# Altium project 0419.PrjPcb
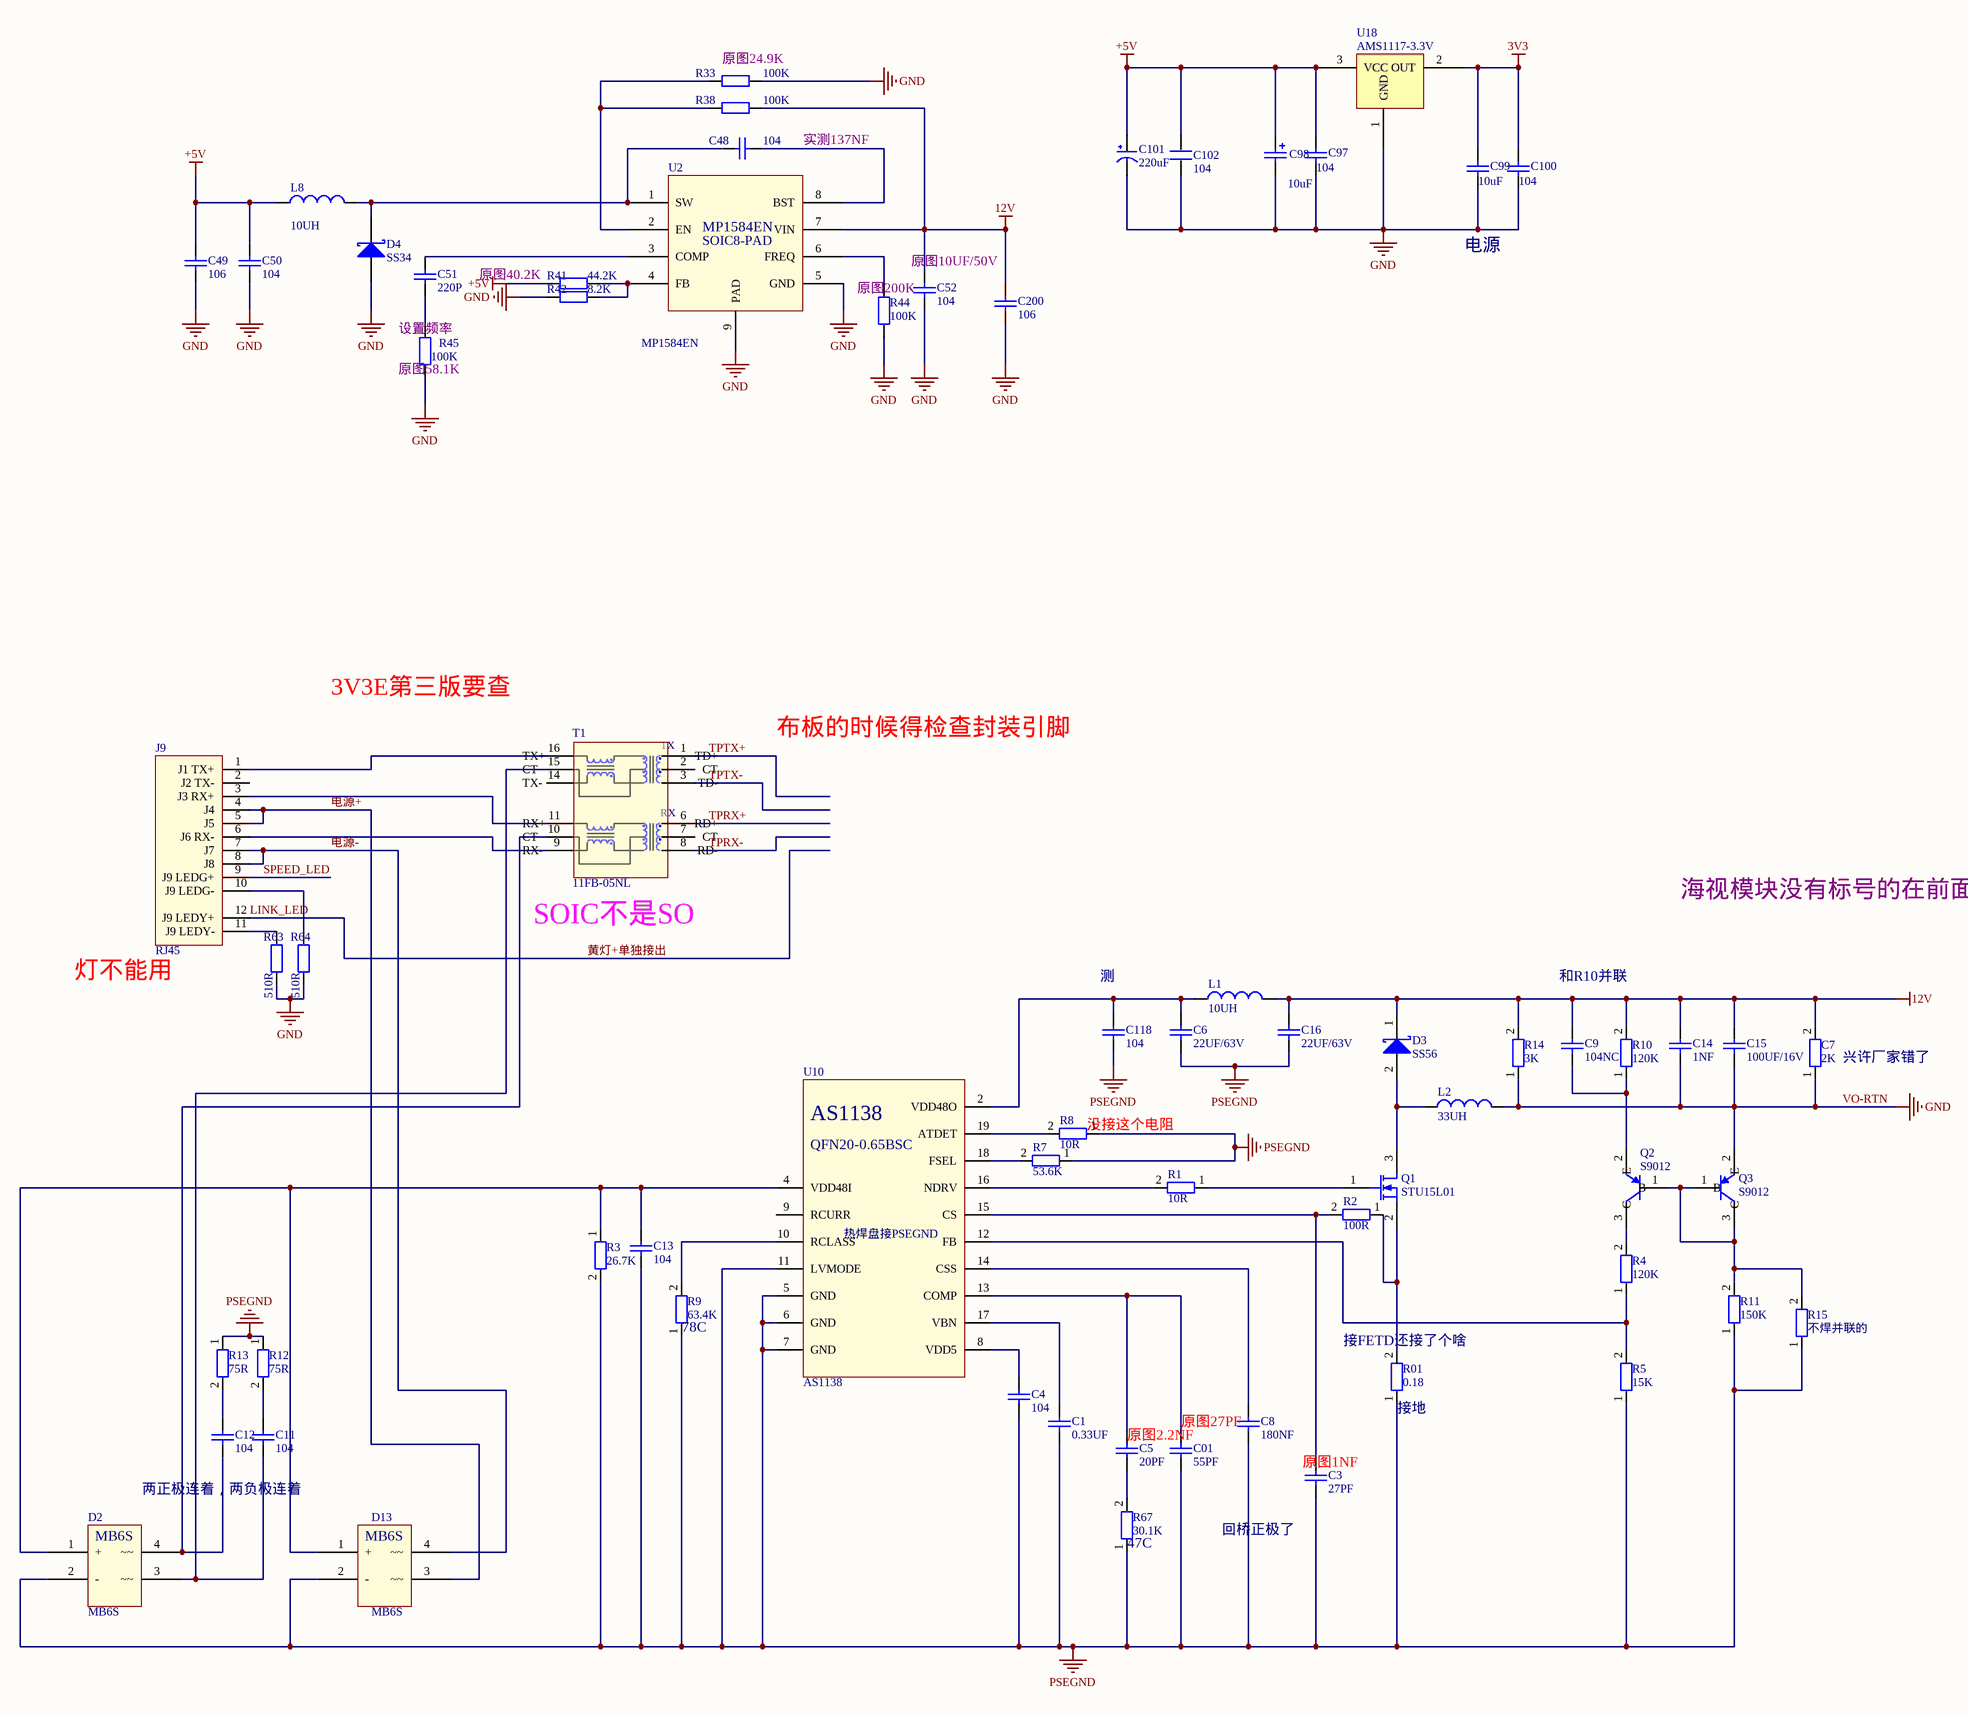
[diagram p0: POWER.SchDoc]
2 sheets, 258 parts. Net scope: global (net labels, ports and power ports of the same name join across sheets).
Board file: 0422.PcbDoc
Sheets:
  POWER.SchDoc
  407VS429.SchDoc

## Sheet POWER.SchDoc
size A2

### Parts
C01  55PF  [0603T]
C1  0.33UF  [0603T]
C3  27PF  [0603T]
C4  104  [0603T]
C5  20PF  [0603T]
C6  22UF/63V  [CAP-SIP]
C7  2K  [0603T]
C8  180NF  [0603T]
C9  104NC  [0603T]
C11  104  [0603T]
C12  104  [0603T]
C13  104  [0603T]
C14  1NF  [1206]
C15  100UF/16V  [CAP-SIP]
C16  22UF/63V  [CAP-SIP]
C48  104  [0603T]
C49  106  [1206]
C50  104  [0603T]
C51  220P  [0603T]
C52  104  [0603T]
C97  104  [0603T]
C98  10uF  [CAP-SIP]
C99  10uF  [0603T]
C100  104  [0603T]
C101  220uF  [7343E型]
C102  104  [0603T]
C118  104  [0603T]
C200  106  [1206]
D2  MB6S  [SOP-4]
D3  SS56  [SMC]
D4  SS34  [SMB]
D13  MB6S  [SOP-4]
J9  RJ45  [RJ45]
L1  10UH  [4*4电感]
L2  33UH  [L10*10]
L8  value 10UH  [6*6电感]  (hidden comment: Inductor)
Q1  STU15L01  [TO-252AA(D-PAK)]
Q2  S9012  [SOT-23]
Q3  S9012  [SOT-23]
R01  0.18  [3.5X2.8X1.9]
R1  10R  [0603T]
R2  100R  [0603T]
R3  26.7K  [0603T]
R4  120K  [0603T]
R5  15K  [0603T]
R7  53.6K  [0603T]
R8  10R  [0603T]
R9  63.4K  [0603T]
R10  120K  [0603T]
R11  150K  [0603T]
R12  75R  [0603T]
R13  75R  [0603T]
R14  3K  [0603T]
R15  不焊并联的  [0603T]
R33  100K  [0603T]
R38  100K  [0603T]
R41  44.2K  [0603T]
R42  8.2K  [0603T]
R44  100K  [0603T]
R45  100K  [0603T]
R63  value 510R  [0603T]  (hidden comment: Res)
R64  value 510R  [0603T]  (hidden comment: Res)
R67  30.1K  [0603T]
T1  11FB-05NL  [SOIC16]
U2  MP1584EN  [SOIC8-PAD]
U10  AS1138  [QFN20-0.65BSC-PAD]
U18  AMS1117-3.3V  [SOT-223]

### Nets
3V3: C99.2 C100.2 U18.2(OUT)
12V: C7.2 C9.1 C14.2 C15.2 C16.2 C52.2 C200.2 D3.1(K) L1.2 R10.2 R14.2 R38.2 U2.7(VIN)
+5V: C49.2 C50.2 C97.2 C98.1 C101.1(VCC) C102.2 L8.1 R41.2 U18.3(VCC)
GND: C7.1 C14.1 C15.1 C49.1 C50.1 C52.1 C97.1 C98.2 C99.1 C100.1 C101.2(GND) C102.1 C200.1 D4.1(A) L2.2 Q3.2(E) R14.1 R33.2 R42.2 R44.2 R45.2 R63.2 R64.2 U2.5(GND) U2.9(PAD) U18.1(GND)  [also labelled VO-RTN]
PSEGND: C01.2 C1.2 C3.2 C4.2 C6.1 C8.2 C13.2 C16.1 C118.1 D2.2(-) D13.2(-) R01.1 R3.2 R5.1 R7.1 R8.1 R9.1 R11.1 R12.1 R13.1 R15.1 R67.1 U10.5(GND) U10.6(GND) U10.7(GND) U10.11(LVMODE)
LINK_LED: J9.12(J9_LEDY+)  [also labelled 黄灯+单独接出]
SPEED_LED: J9.9(J9_LEDG+)
TPRX+: T1.6(RD+)
TPRX-: T1.8(RD-)
TPTX+: T1.1(TD+)
TPTX-: T1.3(TD-)
电源+: D13.3(~~) J9.4(J4) J9.5(J5)
电源-: D13.4(~~) J9.7(J7) J9.8(J8)
NetC01_1: C01.1 C5.1 U10.13(COMP)
NetC1_1: C1.1 U10.17(VBN)
NetC3_1: C3.1 R2.2 U10.15(CS)
NetC4_1: C4.1 U10.8(VDD5)
NetC5_2: C5.2 R67.2
NetC6_2: C6.2 C118.2 L1.1 U10.2(VDD48O)
NetC8_1: C8.1 U10.14(CSS)
NetC9_2: C9.2 Q2.2(E) R10.1
NetC11_1: C11.1 R12.2
NetC11_2: C11.2 D2.3(~~) T1.15(CT)
NetC12_1: C12.1 R13.2
NetC12_2: C12.2 D2.4(~~) T1.10(CT)
NetC13_1: C13.1 D2.1(+) D13.1(+) R3.1 U10.4(VDD48I)
NetC48_1: C48.1 U2.8(BST)
NetC48_2: C48.2 D4.2(K) L8.2 U2.1(SW)
NetC51_1: C51.1 R45.1
NetC51_2: C51.2 U2.3(COMP)
NetD3_2: D3.2(A) L2.1 Q1.3(D)
NetJ9_1: J9.1(J1_TX+) T1.16(TX+)
NetJ9_3: J9.3(J3_RX+) T1.11(RX+)
NetJ9_6: J9.6(J6_RX-) T1.9(RX-)
NetJ9_10: J9.10(J9_LEDG-) R64.1
NetJ9_11: J9.11(J9_LEDY-) R63.1
NetQ1_1: Q1.1(G) R1.1
NetQ1_2: Q1.2(S) R01.2 R2.1
NetQ2_1: Q2.1(B) Q3.1(B) Q3.3(C) R11.2 R15.2
NetQ2_3: Q2.3(C) R4.2
NetR1_2: R1.2 U10.16(NDRV)
NetR4_1: R4.1 R5.2 U10.12(FB)
NetR7_2: R7.2 U10.18(FSEL)
NetR8_2: R8.2 U10.19(ATDET)
NetR9_2: R9.2 U10.10(RCLASS)
NetR33_1: R33.1 R38.1 U2.2(EN)
NetR41_1: R41.1 R42.1 U2.4(FB)
NetR44_1: R44.1 U2.6(FREQ)

Not connected (* = marked no-connect by the designer): J9 2(J2_TX-); T1 2(CT) 7(CT) 14(TX-); U10 9(RCURR)

### Notes on the sheet
- (near R33) 原图24.9K
- 实测137NF
- 原图40.2K
- (near C52) 原图10UF/50V
- 电源
- (near R45) 设置频率
- (near R44) 原图200K
- (near R45) 原图58.1K
- 3V3E第三版要查
- 布板的时候得检查封装引脚
- (near T1) SOIC不是SO
- 海视模块没有标号的在前面添0
- 灯不能用
- (near C118) 测
- 和R10并联
- (near C7) 兴许厂家错了
- (near R8) 没接这个电阻
- (near U10) 热焊盘接PSEGND
- (near R9) 78C
- (near R01) 接FETD还接了个啥
- 原图27PF
- (near R01) 接地
- 两正极连着，两负极连着
- 原图2.2NF
- (near C3) 原图1NF
- (near R67) 47C
- 回桥正极了
- (in symbol 11FB-05NL) TX; RX
- (in symbol AS1138) QFN20-0.65BSC
- (in symbol MP1584EN顺序) SOIC8-PAD

### Library data of the parts
C01 C1 C3-C6 C8 C9 C11-C16 C48-C52 C118 C200 = Cap: Capacitor; Value: 100pF; Published: 8-Jun-2000; LatestRevisionDate: 17-Jul-2002; LatestRevisionNote: Re-released for DXP Platform.; PackageReference: RAD-0.3; Publisher: Altium Limited; PackageDescription: Radial Cap, Thru-Hole; 2 Leads; 0.3 in Pin Spacing
C7 R01 R1-R5 R7-R15 R33 R38 R41 R42 R44 R45 R67 = Res2: Resistor; Value: 1K; Published: 8-Jun-2000; LatestRevisionDate: 17-Jul-2002; LatestRevisionNote: Re-released for DXP Platform.; PackageReference: AXIAL-0.4; Publisher: Altium Limited; PackageDescription: Axial Device, Thru-Hole; 2 Leads; 0.4 in Pin Spacing
C97 C100 = Cap: Capacitor; Value: 100nF; Published: 8-Jun-2000; LatestRevisionDate: 17-Jul-2002; LatestRevisionNote: Re-released for DXP Platform.; PackageReference: RAD-0.3; Publisher: Altium Limited; PackageDescription: Radial Cap, Thru-Hole; 2 Leads; 0.3 in Pin Spacing
C98 = Cap Pol2: Polarized Capacitor (Axial); Published: 8-Jun-2000; LatestRevisionDate: 17-Jul-2002; LatestRevisionNote: Re-released for DXP Platform.; PackageReference: POLAR0.8; Publisher: Altium Limited; PackageDescription: Polarized Capacitor; 2 Leads; Value: 10uF
C99 = Cap: Capacitor; Published: 8-Jun-2000; LatestRevisionDate: 17-Jul-2002; LatestRevisionNote: Re-released for DXP Platform.; PackageReference: RAD-0.3; Publisher: Altium Limited; PackageDescription: Radial Cap, Thru-Hole; 2 Leads; 0.3 in Pin Spacing; Value: 10uF
C101 = CAP
C102 = C
D3 = Diode 10TQ035: Schottky Rectifier; Note: Terminal 2 is the TAB and is electrically connected to the cathode; Published: 8-Jun-2000; LatestRevisionDate: 17-Jul-2002; LatestRevisionNote: Re-released for DXP Platform.; DatasheetVersion: PD-2.057B; PackageVersion: Feb-1998; PackageReference: TO-220AC; Publisher: Altium Limited; PackageDescription: TO, Thru-Hole, Vertical, Heatsink Mounted; 3 In-Line Leads (1 Absent); Pitch 2.54 mm; ComponentLink1Description: Manufacturer Link; ComponentLink1URL: http://www.irf.com/; ComponentLink2Description: Datasheet; ComponentLink2URL: http://www.irf.com/product-info/datasheets/data/10tq.pdf
D4 = D Schottky: Schottky Diode; Published: 8-Jun-2000; LatestRevisionDate: 17-Jul-2002; LatestRevisionNote: Re-released for DXP Platform.; PackageReference: SMB; Publisher: Altium Limited; PackageDescription: DO-214-AA/SMB; 2 C-Bend Leads; Body 5.3 x 3.6 mm, inc. leads (LxW); Code_JEDEC: DO-214-AA
L1 L8 = Inductor: Code_IEC: 1005; Published: 8-Jun-2000; LatestRevisionDate: 29-May-2009; LatestRevisionNote: IPC-7351 Footprint Added.; PackageReference: 0402-A; Publisher: Altium Limited; PackageDescription: Chip Inductor; Code_JEITA: 0402
  L1: Value: 10UH
L2 = Inductor: Code_IEC: 1005; Value: 10UH; Published: 8-Jun-2000; LatestRevisionDate: 29-May-2009; LatestRevisionNote: IPC-7351 Footprint Added.; PackageReference: 0402-A; Publisher: Altium Limited; PackageDescription: Chip Inductor; Code_JEITA: 0402
Q1 = MOSFET-N: N-Channel MOSFET; Published: 8-Jun-2000; LatestRevisionDate: 17-Jul-2002; LatestRevisionNote: Re-released for DXP Platform.; PackageVersion: 1995/1996; PackageReference: E3; Publisher: Altium Limited; PackageDescription: TO, Flat Index; 3 In-Line, Axial Leads; Body Dia. 4.6mm; Lead Dia. 0.5 mm (max)
Q2 Q3 = S9012: NPN General Purpose Amplifier; Published: 8-Jun-2000; LatestRevisionDate: 15-Jan-2003; LatestRevisionNote: PCB Footprint 'BCY-W3/D4.7' replaced; DatasheetVersion: 1997; PackageVersion: Sep-1998; PackageReference: TO-92A; Publisher: Altium Limited; PackageDescription: TO, Flat Index; 3 In-Line, Axial Leads; Body Dia. 4.5mm; Leads 0.51 x 0.48 mm (max); ComponentLink1Description: Manufacturer Link; ComponentLink1URL: http://www.fairchildsemi.com/; ComponentLink2Description: Datasheet; ComponentLink2URL: http://www.fairchildsemi.com/ds/2N%2F2N3904.pdf
R63 R64 = Res2: Resistor; Published: 8-Jun-2000; LatestRevisionDate: 17-Jul-2002; LatestRevisionNote: Re-released for DXP Platform.; PackageReference: AXIAL-0.4; Publisher: Altium Limited; PackageDescription: Axial Device, Thru-Hole; 2 Leads; 0.4 in Pin Spacing
U2 = MP1584EN顺序
U18 = 11

## Sheet 407VS429.SchDoc
size A1; Organization: Protel International P/L; Address1: L3, 12a Rodborough Rd; Address2: Frenchs Forest; Address3: NSW; Address4: Australia 2086
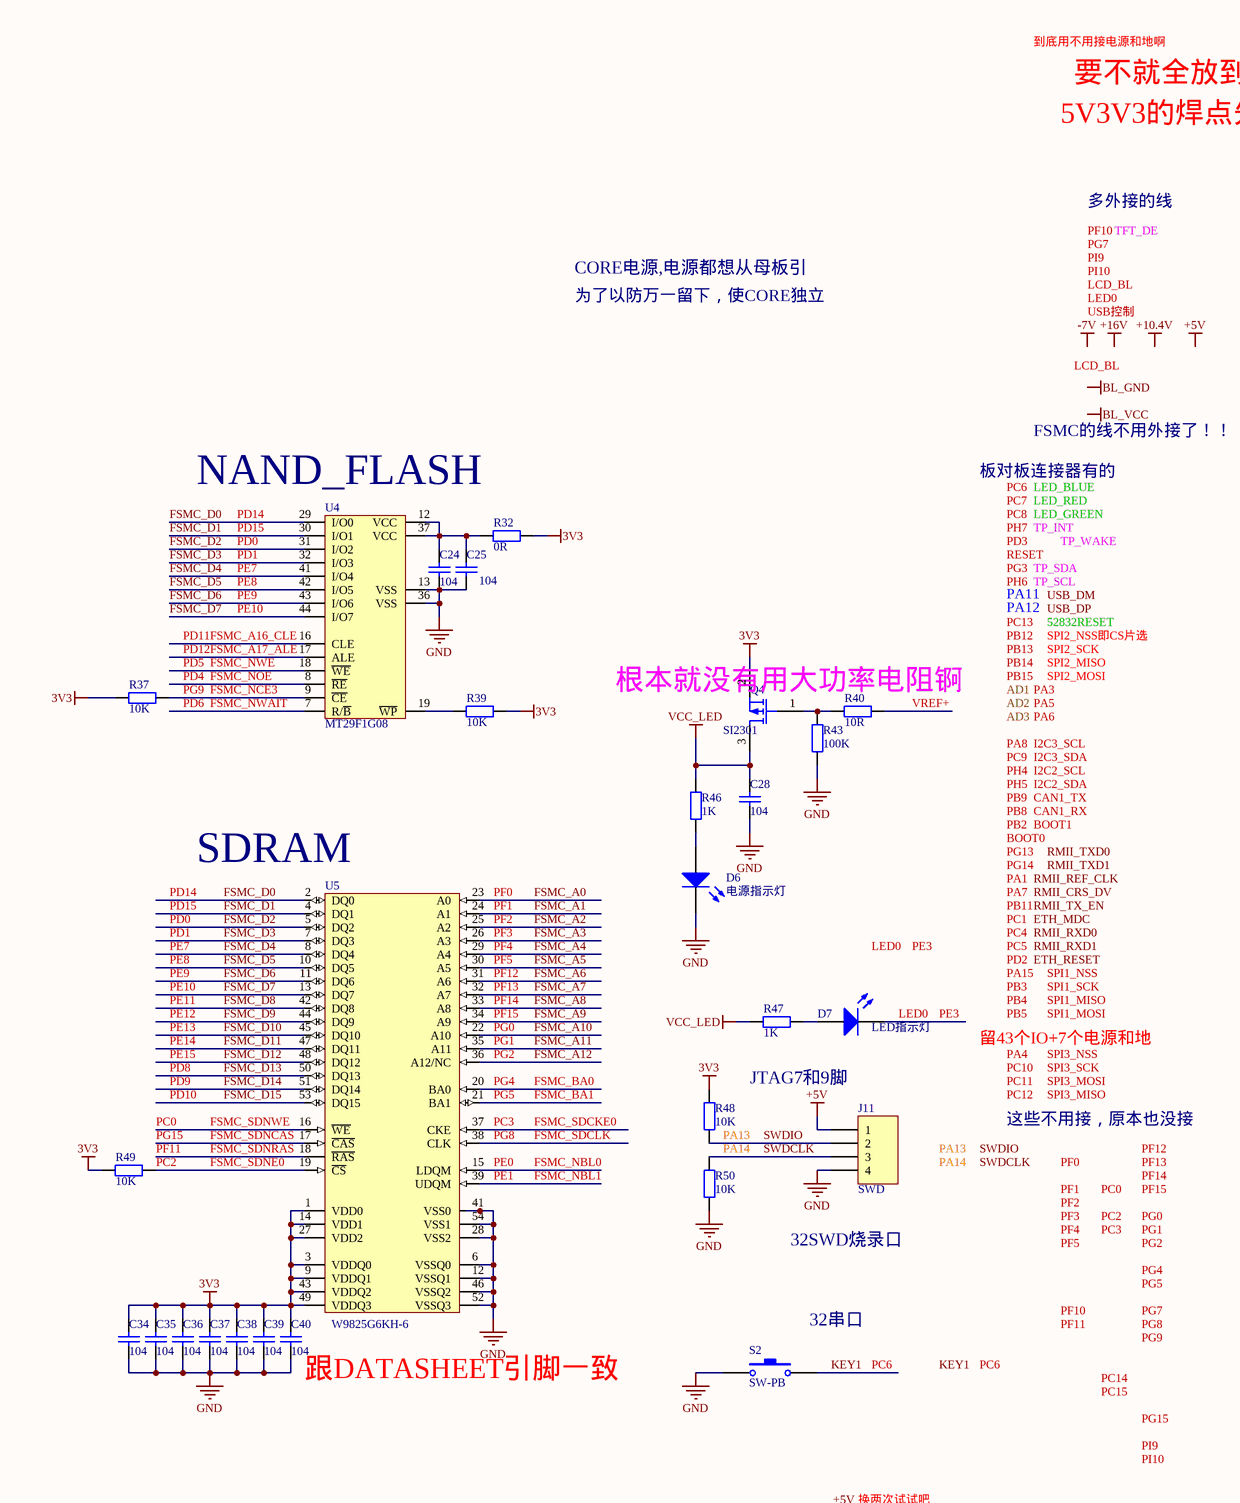
[diagram p1: 407VS429.SchDoc, top left]
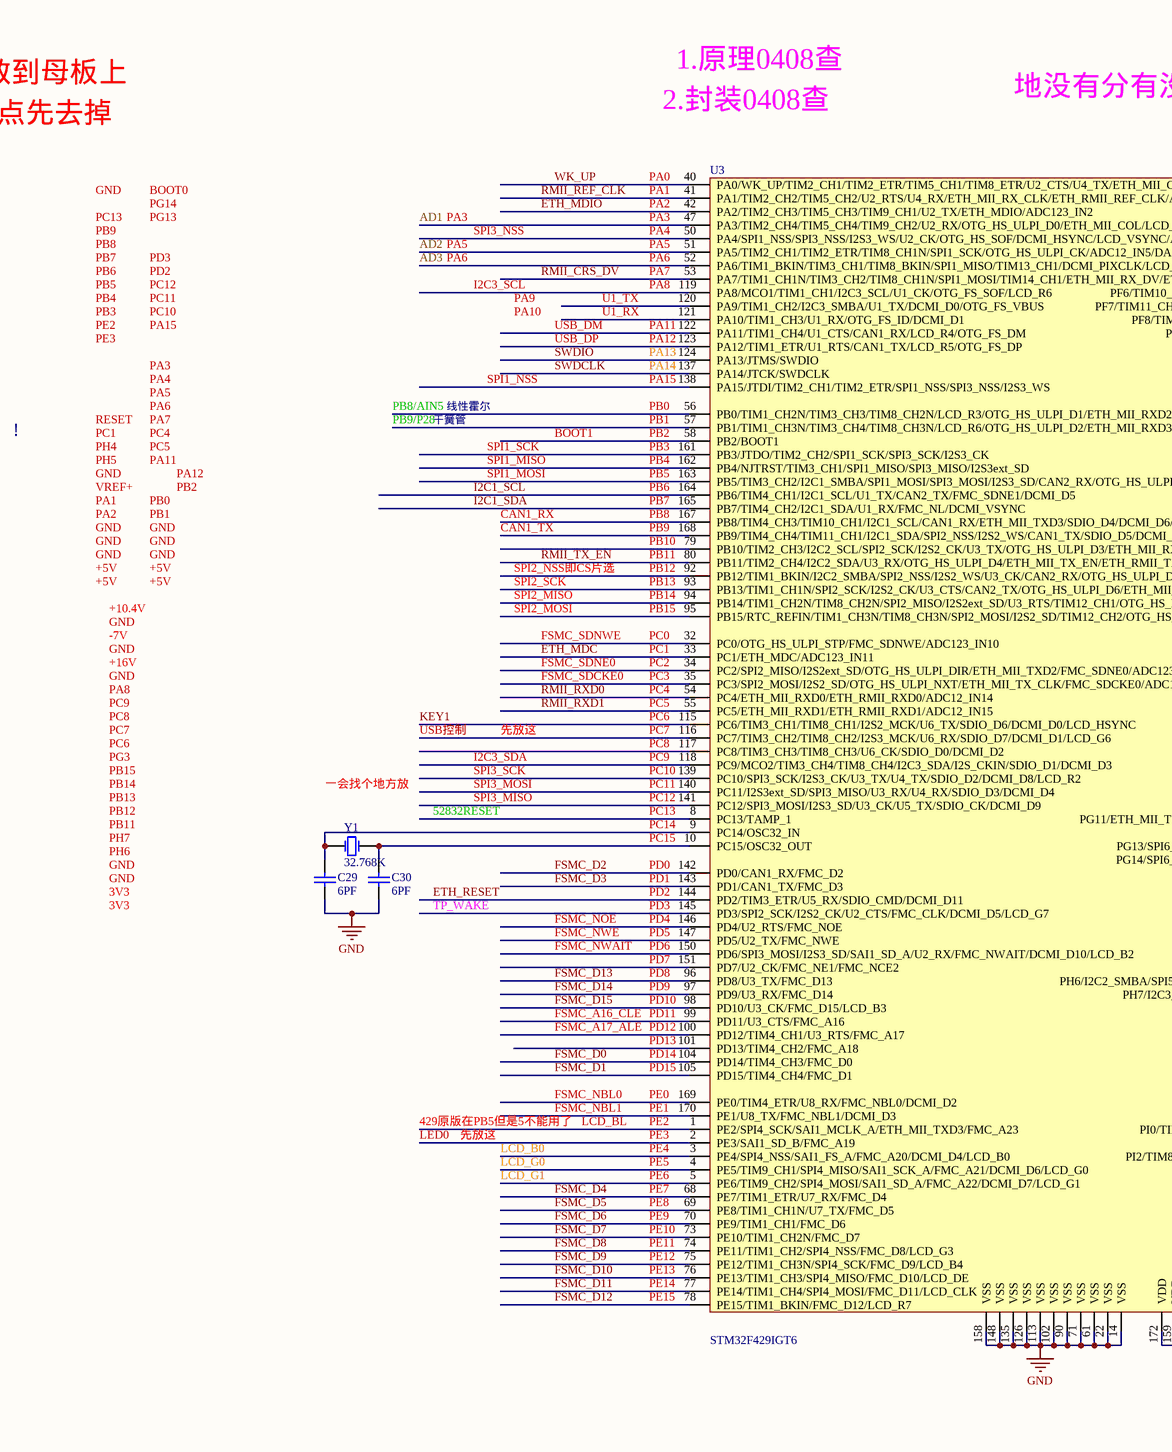
[diagram p2: 407VS429.SchDoc, top middle]
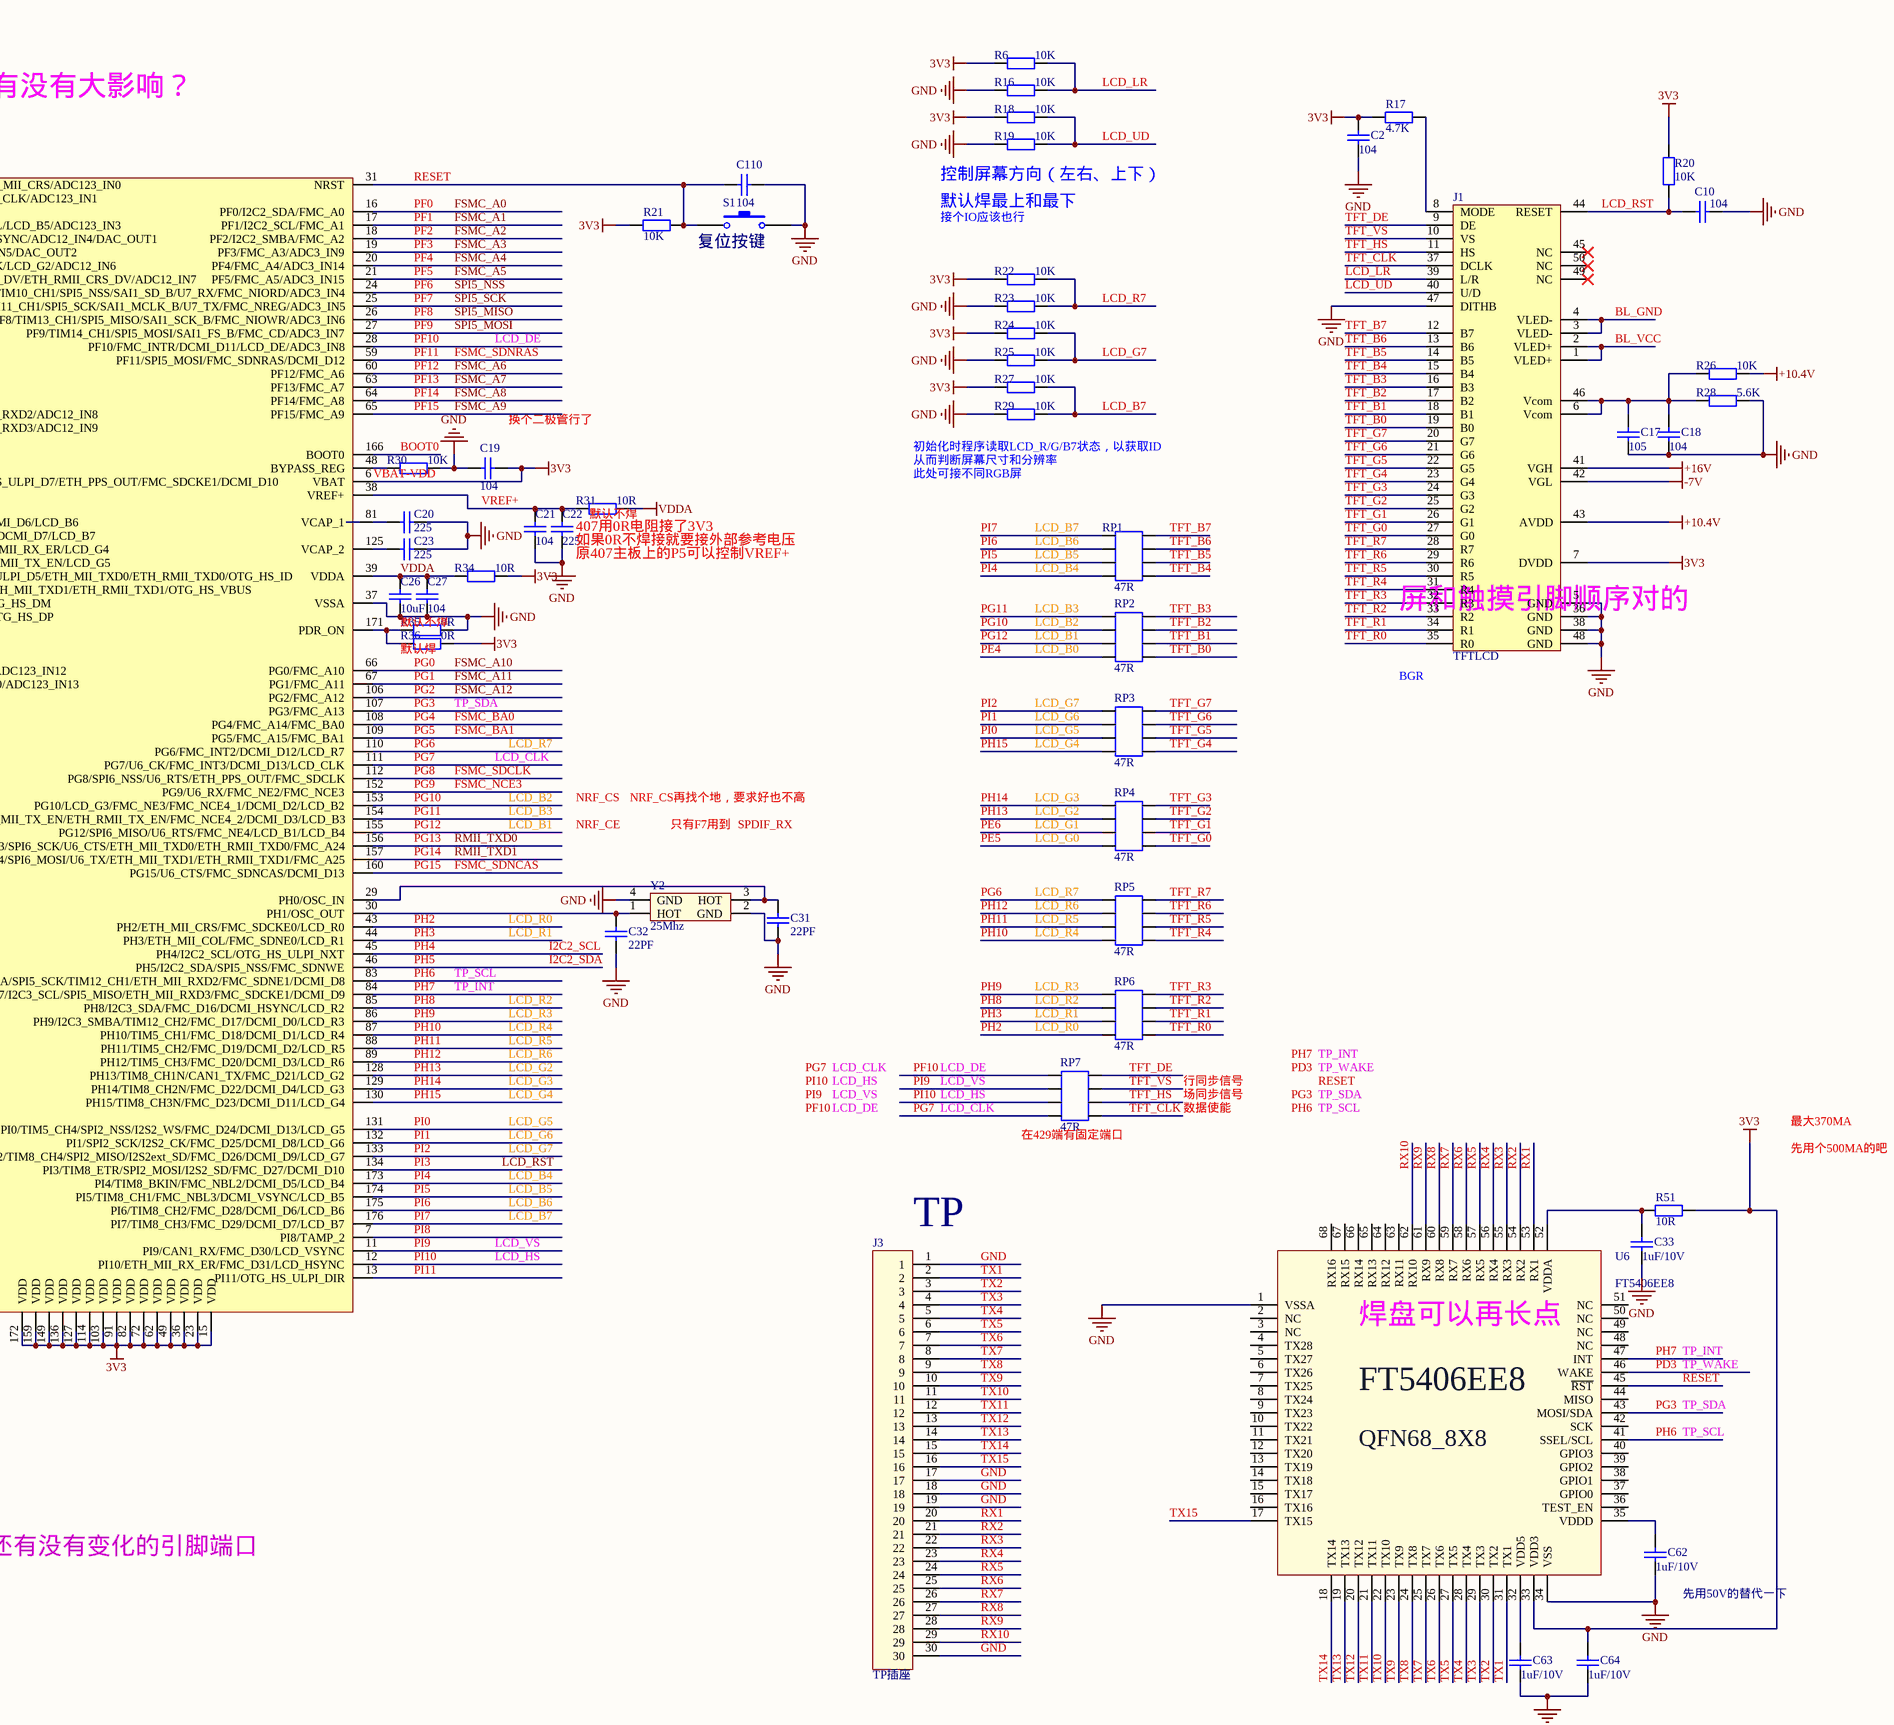
[diagram p3: 407VS429.SchDoc, top right]
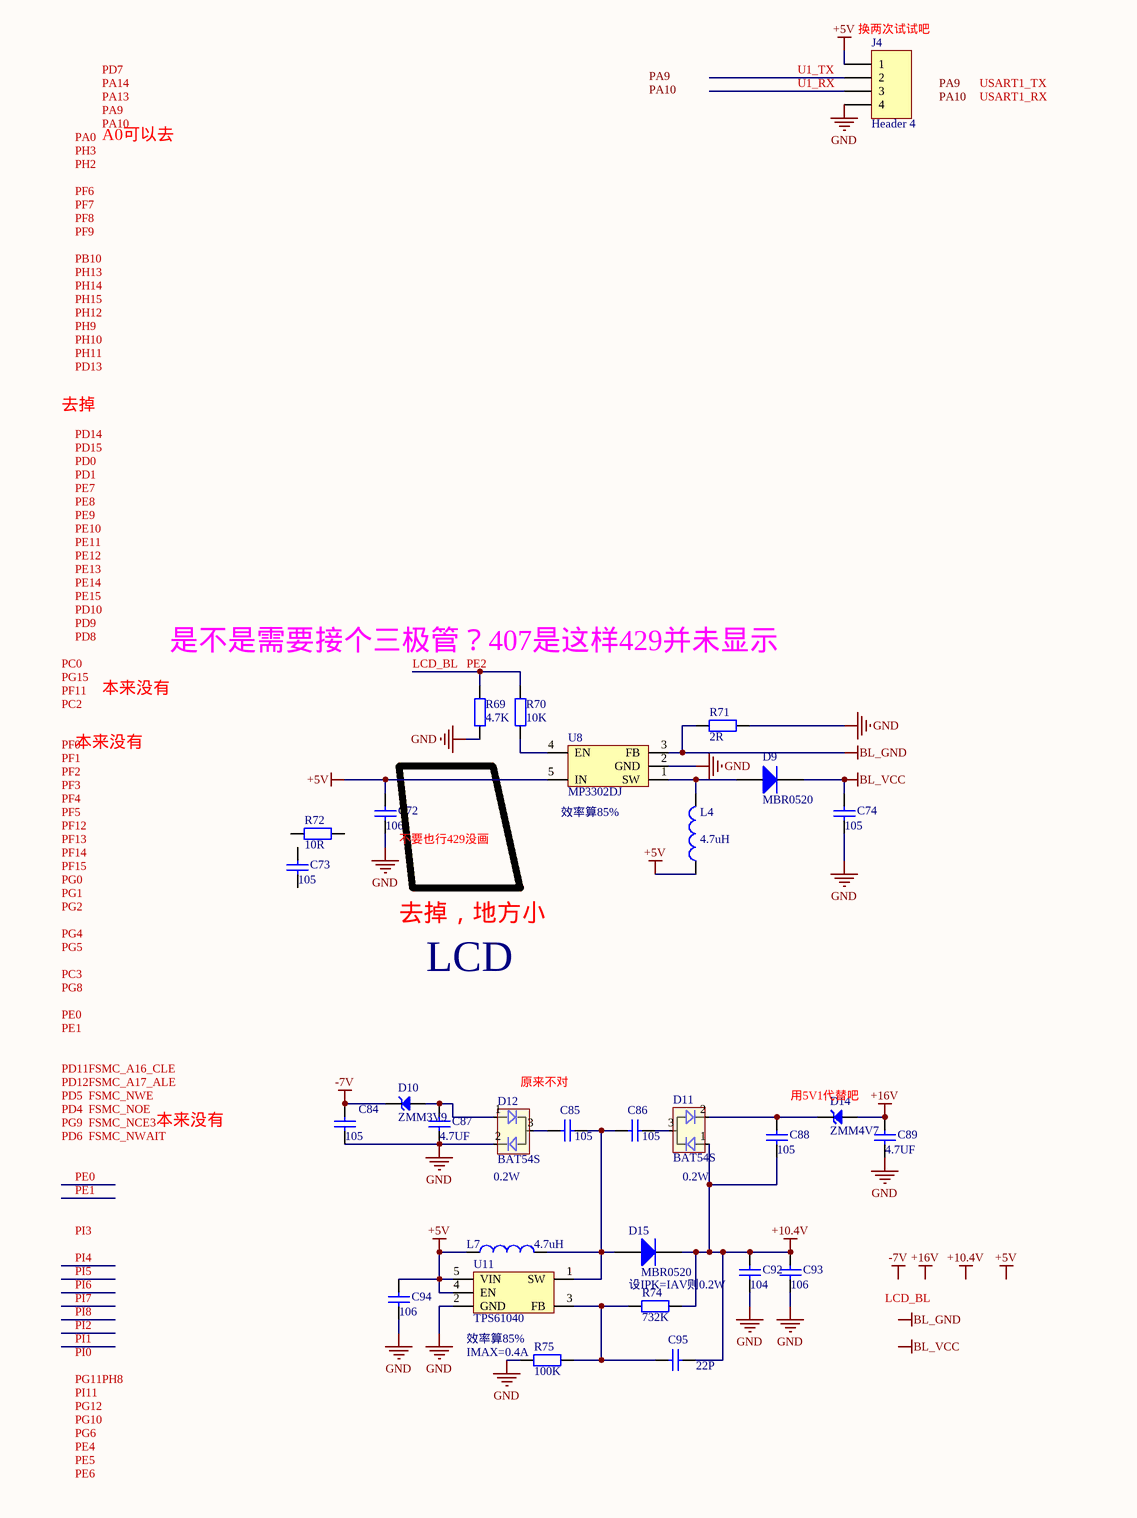
[diagram p4: 407VS429.SchDoc, bottom left]
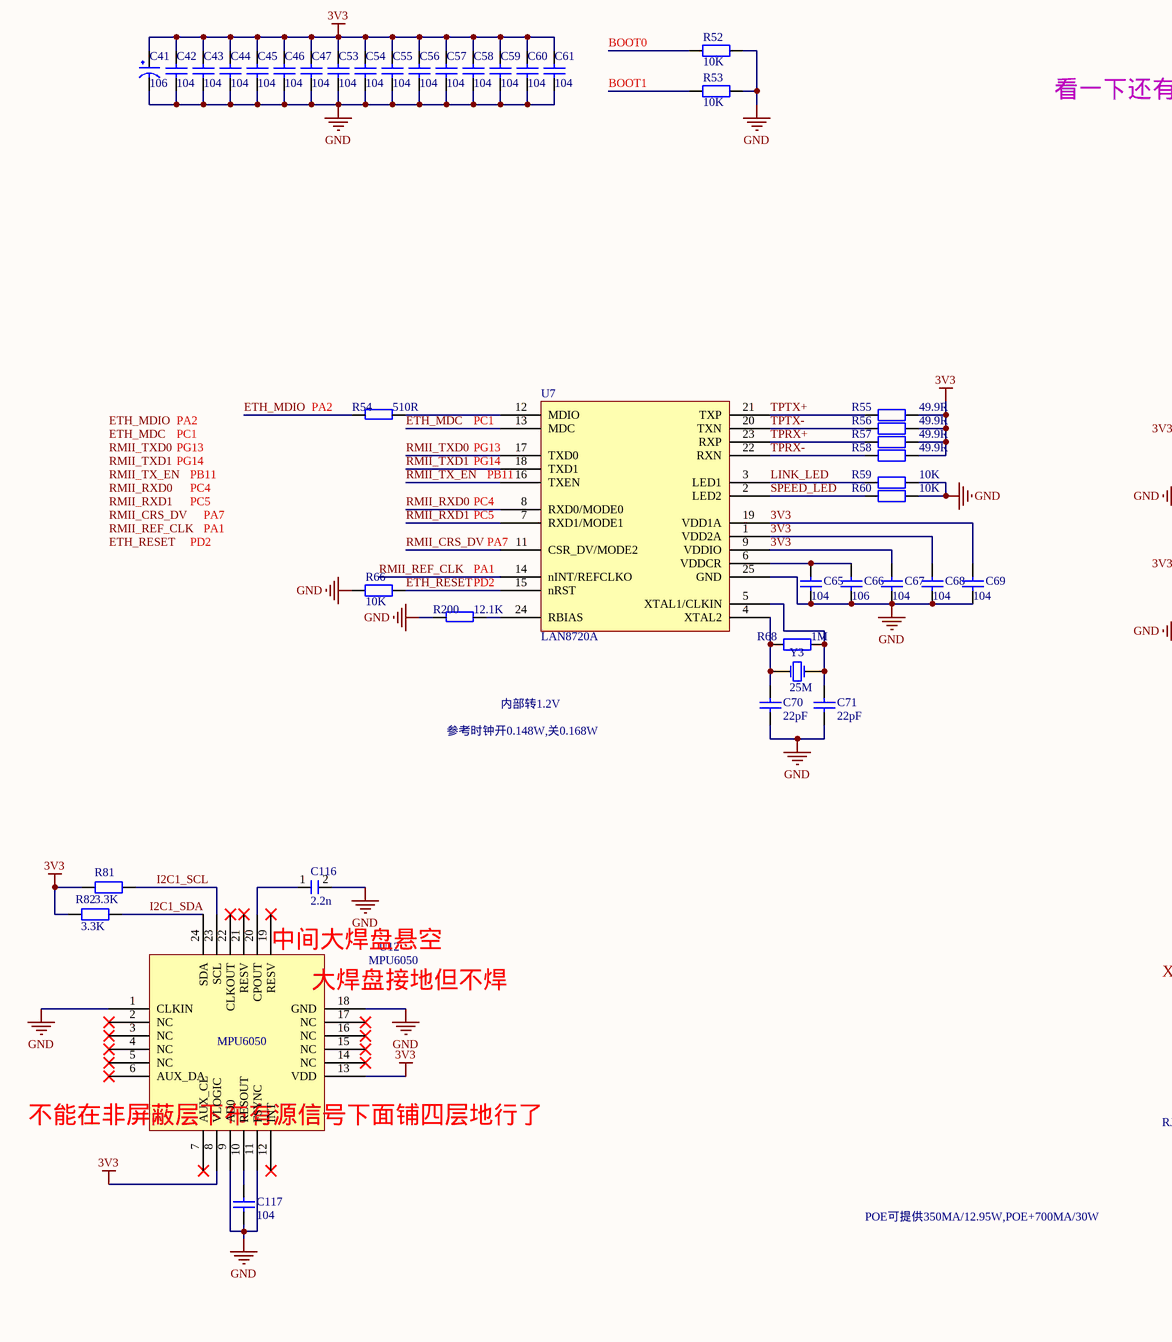
[diagram p5: 407VS429.SchDoc, bottom middle]
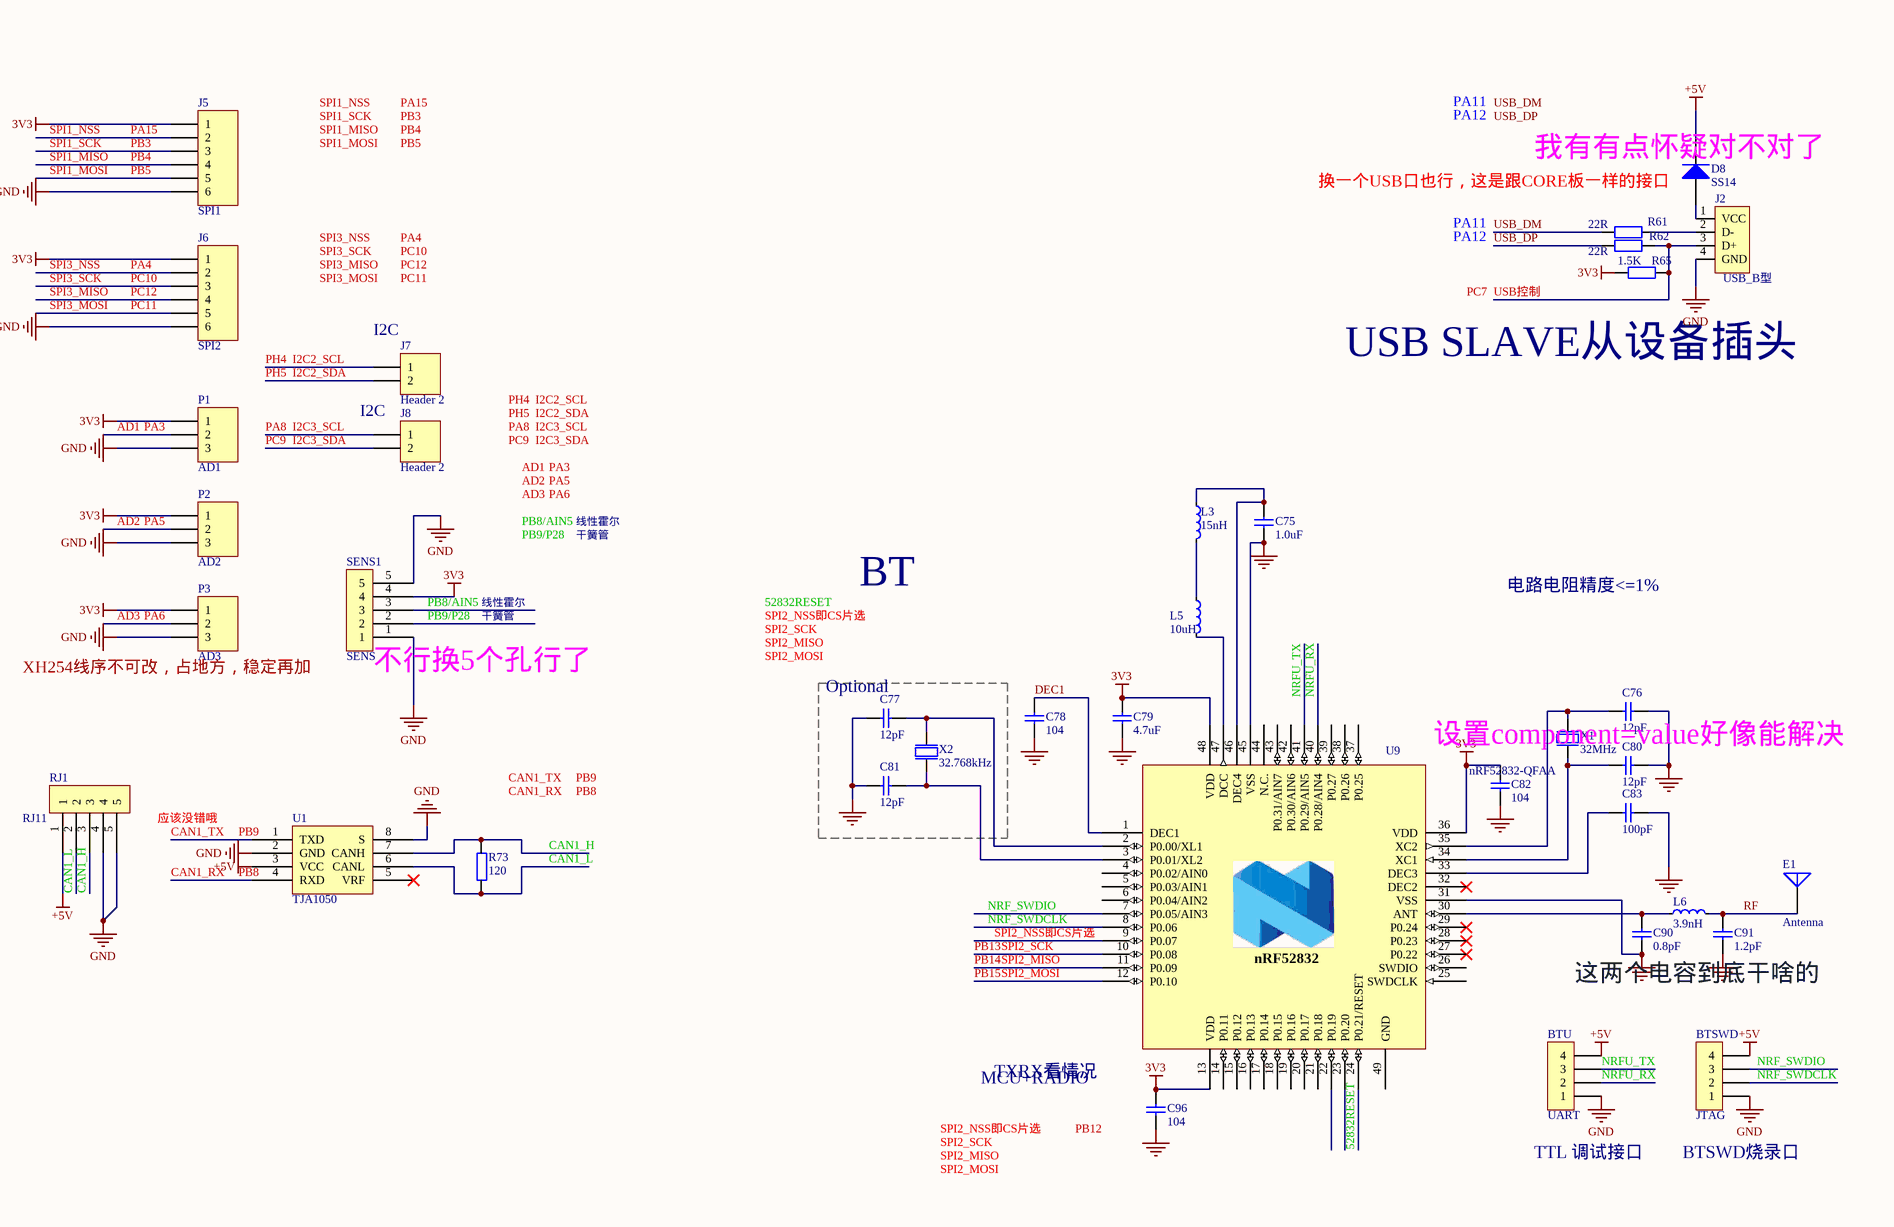
[diagram p6: 407VS429.SchDoc, bottom right]

### Parts
BTSWD  JTAG  [HDR1X4]
BTU  UART  [HDR1X4]
C2  104  [0603T]
C10  104  [0603T]
C17  105  [0603T]
C18  104  [0603T]
C19  104  [0603T]
C20  225  [0603T]
C21  104  [0603T]
C22  225  [0603T]
C23  225  [0603T]
C24  104  [0603T]
C25  104  [0603T]
C26  10uF  [0603T]
C27  104  [0603T]
C28  104  [0603T]
C29  6PF  [0603T]
C30  6PF  [0603T]
C31  22PF  [0603T]
C32  22PF  [0603T]
C33  1uF/10V  [1206]
C34  104  [0603T]
C35  104  [0603T]
C36  104  [0603T]
C37  104  [0603T]
C38  104  [0603T]
C39  104  [0603T]
C40  104  [0603T]
C41  106  [0603T]
C42  104  [0603T]
C43  104  [0603T]
C44  104  [0603T]
C45  104  [0603T]
C46  104  [0603T]
C47  104  [0603T]
C53  104  [0603T]
C54  104  [0603T]
C55  104  [0603T]
C56  104  [0603T]
C57  104  [0603T]
C58  104  [0603T]
C59  104  [0603T]
C60  104  [0603T]
C61  104  [0603T]
C62  1uF/10V  [1206]
C63  1uF/10V  [1206]
C64  1uF/10V  [1206]
C65  104  [0603T]
C66  106  [0603T]
C67  104  [0603T]
C68  104  [0603T]
C69  104  [0603T]
C70  22pF  [0603T]
C71  22pF  [0603T]
C72  106  [0603T]
C73  105  [0603T]
C74  105  [0603T]
C75  1.0uF  [0603T]
C76  12pF  [0603T]
C77  12pF  [0603T]
C78  104  [0603T]
C79  4.7uF  [0603T]
C80  12pF  [0603T]
C81  12pF  [0603T]
C82  104  [0603T]
C83  100pF  [0603T]
C84  105  [0603T]
C85  105  [0603T]
C86  105  [0603T]
C87  4.7UF  [0603T]
C88  105  [0603T]
C89  4.7UF  [0603T]
C90  0.8pF  [0603T]
C91  1.2pF  [0603T]
C92  104  [0603T]
C93  106  [0603T]
C94  106  [0603T]
C95  22P  [0603T]
C96  104  [0603T]
C110  104  [0603T]
C116  2.2n  [0603T]
C117  104  [0603T]
D6  电源指示灯  [0603T]
D7  LED指示灯  [0603T]
D8  SS14  [SMC]
D9  MBR0520  [SOD-123]
D10  ZMM3V9  [DIODE_ZMMx]
D11  BAT54S  [SOT-23]
D12  BAT54S  [SOT-23]
D14  ZMM4V7  [DIODE_ZMMx]
D15  MBR0520  [SOD-123]
E1  Antenna  [ANT2.4G2]
J1  TFTLCD  [FPC-TOP50]
J2  USB_B型  [USB2.5-2H4D]
J3  TP插座  [FPC-TOP30]
J4  Header 4  [HDR1X4]
J5  SPI1  [HDR1X6]
J6  SPI2  [HDR1X6]
J7  Header 2  [HDR1X2]
J8  Header 2  [HDR1X2]
J11  SWD  [HDR1X4]
L3  15nH  [CL-0805]
L4  value 4.7uH  [L10*10]  (hidden comment: Inductor)
L5  10uH  [CL-0805]
L6  3.9nH  [CL-0805]
L7  value 4.7uH  [L10*10]  (hidden comment: Inductor)
P1  AD1  [HDR1X3]
P2  AD2  [HDR1X3]
P3  AD3  [HDR1X3]
Q4  SI2301  [SOT-23]
R6  10K  [0603T]
R16  10K  [0603T]
R17  value 4.7K  [0603T]  (hidden comment: Res)
R18  10K  [0603T]
R19  10K  [0603T]
R20  10K  [0603T]
R21  value 10K  [0603T]  (hidden comment: Res)
R22  10K  [0603T]
R23  10K  [0603T]
R24  value 10K  [0603T]  (hidden comment: Res)
R25  value 10K  [0603T]  (hidden comment: Res)
R26  10K  [0603T]
R27  value 10K  [0603T]  (hidden comment: Res)
R28  5.6K  [0603T]
R29  value 10K  [0603T]  (hidden comment: Res)
R30  10K  [0603T]
R31  10R  [0603T]
R32  value 0R  [0603T]  (hidden comment: 0)
R34  10R  [0603T]
R35  value 0R  [0603T]  (hidden comment: Res)
R36  value 0R  [0603T]  (hidden comment: Res)
R37  10K  [0603T]
R39  10K  [0603T]
R40  10R  [0603T]
R43  100K  [0603T]
R46  1K  [0603T]
R47  1K  [0603T]
R48  value 10K  [0603T]  (hidden comment: Res)
R49  10K  [0603T]
R50  value 10K  [0603T]  (hidden comment: Res)
R51  10R  [0603T]
R52  value 10K  [0603T]  (hidden comment: Res)
R53  10K  [0603T]
R54  510R  [0603T]
R55  49.9R  [0603T]
R56  value 49.9R  [0603T]  (hidden comment: Res)
R57  49.9R  [0603T]
R58  value 49.9R  [0603T]  (hidden comment: Res)
R59  10K  [0603T]
R60  10K  [0603T]
R61  22R  [0603T]
R62  22R  [0603T]
R65  1.5K  [0603T]
R66  value 10K  [0603T]  (hidden comment: 160R)
R68  1M  [0603T]
R69  4.7K  [0603T]
R70  10K  [0603T]
R71  value 2R  [2512公制6432]  (hidden comment: Res)
R72  value 10R  [2512公制6432]  (hidden comment: Res2)
R73  120  [0603T]
R74  732K  [0603T]
R75  100K  [0603T]
R81  3.3K  [0603T]
R82  3.3K  [0603T]
R200  12.1K  [0603T]
RJ1  RJ11  [CAN接口]
RP1  47R  [8P4R_0603]
RP2  47R  [8P4R_0603]
RP3  47R  [8P4R_0603]
RP4  47R  [8P4R_0603]
RP5  47R  [8P4R_0603]
RP6  47R  [8P4R_0603]
RP7  47R  [8P4R_0603]
S1  SW-PB  [KEY3*6]  (value not drawn)
S2  SW-PB  [KEY3*6]
SENS1  SENS  [传感器接口]
U1  TJA1050  [SO-8]
U3  STM32F429IGT6  [LQFP176]
U4  MT29F1G08  [TSOP48]
U5  W9825G6KH-6  [TSOP54]
U6  FT5406EE8  [QFN68-0.4mm]
U7  LAN8720A  [QFN24]
U8  MP3302DJ  [SOT-23-5]
U9  nRF52832-QFAA  [QFN48]
U11  TPS61040  [SOT-23-5]
U12  MPU6050  [QFN20-0.5BSC-PAD]
X1  32MHz  [3225晶振贴片]
X2  32.768kHz  [3215贴片晶振32.768K]
Y1  32.768K  [3215贴片晶振32.768K]
Y2  25Mhz  [XTAL3225]
Y3  25M  [X-HC49-SMT]

### Blocks framed on the sheet
Optional: C77 C81 X2

### Nets
3V3: C2.2 C19.1 C34.2 C35.2 C36.2 C37.2 C38.2 C39.2 C40.2 C41.1(VCC) C42.2 C43.2 C44.2 C45.2 C46.2 C47.2 C53.2 C54.2 C55.2 C56.2 C57.2 C58.2 C59.2 C60.2 C61.2 C64.2 C67.2 C68.2 C69.2 C79.1 C82.1 C96.1 J1.7(DVDD) J5.1 J6.1 P1.1 P2.1 P3.1 Q4.2(S) R6.2 R17.1 R18.2 R20.1 R21.2 R22.2 R24.2 R27.2 R32.2 R34.1 R36.1 R37.1 R39.2 R48.2 R49.1 R51.2 R55.1 R56.1 R57.1 R58.1 R65.1 R81.1 R82.1 SENS1.4 U3.6(VBAT) U3.15(VDD) U3.23(VDD) U3.36(VDD) U3.49(VDD) U3.62(VDD) U3.72(VDD) U3.82(VDD) U3.91(VDD) U3.103(VDD) U3.114(VDD) U3.127(VDD) U3.136(VDD) U3.149(VDD) U3.159(VDD) U3.172(VDD) U5.1(VDD0) U5.3(VDDQ0) U5.9(VDDQ1) U5.14(VDD1) U5.27(VDD2) U5.43(VDDQ2) U5.49(VDDQ3) U6.33(VDD3) U7.1(VDD2A) U7.9(VDDIO) U7.19(VDD1A) U9.13(VDD) U9.36(VDD) U9.48(VDD) U12.8(VLOGIC) U12.13(VDD)
+5V: BTSWD.4 BTU.4 C72.2 C94.2 D8.2(K) J4.1 J11.1 L4.1 L7.1 RJ1.1 U1.3(VCC) U8.5(IN) U11.4(EN) U11.5(VIN)
+10.4V: C88.2 C92.2 C93.2 C95.1 D11.1 D15.2(K) J1.43(AVDD) R26.2 R74.1
+16V: C89.2 D14.1 J1.41(VGH)
-7V: C84.1 D10.2 J1.42(VGL)
BL_GND: J1.3(VLED-) J1.4(VLED-) R71.2 U8.3(FB)
BL_VCC: C74.2 D9.2(K) J1.1(VLED+) J1.2(VLED+)
GND: BTSWD.1 BTU.1 C2.1 C10.1 C17.1 C18.1 C19.2 C20.1 C21.1 C22.1 C23.1 C24.1 C25.1 C26.1 C27.1 C28.1 C29.2 C30.2 C31.2 C32.1 C33.1 C34.1 C35.1 C36.1 C37.1 C38.1 C39.1 C40.1 C41.2(GND) C42.1 C43.1 C44.1 C45.1 C46.1 C47.1 C53.1 C54.1 C55.1 C56.1 C57.1 C58.1 C59.1 C60.1 C61.1 C62.1 C63.1 C64.1 C65.1 C66.1 C67.1 C68.1 C69.1 C70.2 C71.2 C72.1 C74.1 C75.1 C76.2 C77.2 C78.2 C79.2 C80.2 C81.2 C82.2 C83.2 C84.2 C87.1 C89.1 C90.1 C91.1 C92.1 C93.1 C94.1 C96.2 C110.1 C116.2 C117.1 D6.2(K) D12.2 J1.5(GND) J1.36(GND) J1.38(GND) J1.47(DITHB) J1.48(GND) J2.4(GND) J3.1 J3.17 J3.18 J3.19 J3.30 J4.4 J5.6 J6.6 J11.4 P1.3 P2.3 P3.3 R16.2 R19.2 R23.2 R25.2 R28.2 R29.2 R30.1 R35.1 R43.1 R50.1 R52.1 R53.1 R59.1 R60.1 R66.2 R69.2 R71.1 R75.2 R200.2 RJ1.4 RJ1.5 S1.2 S2.1 SENS1.1 SENS1.5 U1.2(GND) U1.8(S) U3.14(VSS) U3.22(VSS) U3.37(VSSA) U3.61(VSS) U3.71(VSS) U3.90(VSS) U3.102(VSS) U3.113(VSS) U3.126(VSS) U3.135(VSS) U3.148(VSS) U3.158(VSS) U4.13(VSS) U4.36(VSS) U5.6(VSSQ0) U5.12(VSSQ1) U5.28(VSS2) U5.41(VSS0) U5.46(VSSQ2) U5.52(VSSQ3) U5.54(VSS1) U6.1(VSSA) U6.34(VSS) U7.25(GND) U8.2(GND) U9.31(VSS) U9.45(VSS) U11.2(GND) U12.1(CLKIN) U12.9(AD0) U12.11(FSYNC) U12.18(GND) X1.2(GND) X1.4(GND) Y2.2(GND) Y2.4(GND)
VCC_LED: C28.2 Q4.3(D) R46.1 R47.1
VDDA: C26.2 C27.2 R31.1 R34.2 U3.39(VDDA)
52832RESET: U3.8(PC13/TAMP_1) U9.24(P0.21/RESET)  [also labelled PC13]
AD1: P1.2 U3.47(PA3/TIM2_CH4/TIM5_CH4/TIM9_CH2/U2_RX/OTG_HS_ULPI_D0/ETH_MII_COL/LCD_B5/ADC123_IN3)  [also labelled PA3]
AD2: P2.2 U3.51(PA5/TIM2_CH1/TIM2_ETR/TIM8_CH1N/SPI1_SCK/OTG_HS_ULPI_CK/ADC12_IN5/DAC_OUT2)  [also labelled PA5]
AD3: P3.2 U3.52(PA6/TIM1_BKIN/TIM3_CH1/TIM8_BKIN/SPI1_MISO/TIM13_CH1/DCMI_PIXCLK/LCD_G2/ADC12_IN6)  [also labelled PA6]
BOOT0: R52.2 U3.166(BOOT0)
BOOT1: R53.2 U3.58(PB2/BOOT1)  [also labelled PB2]
CAN1_H: R73.2 RJ1.3 U1.7(CANH)
CAN1_L: R73.1 RJ1.2 U1.6(CANL)
CAN1_RX: U1.4(RXD) U3.167(PB8/TIM4_CH3/TIM10_CH1/I2C1_SCL/CAN1_RX/ETH_MII_TXD3/SDIO_D4/DCMI_D6/LCD_B6)  [also labelled PB8]
CAN1_TX: U1.1(TXD) U3.168(PB9/TIM4_CH4/TIM11_CH1/I2C1_SDA/SPI2_NSS/I2S2_WS/CAN1_TX/SDIO_D5/DCMI_D7/LCD_B7)  [also labelled PB9]
DEC1: C78.1 U9.1(DEC1)
ETH_MDC: U3.33(PC1/ETH_MDC/ADC123_IN11) U7.13(MDC)  [also labelled PC1]
ETH_MDIO: R54.2 U3.42(PA2/TIM2_CH3/TIM5_CH3/TIM9_CH1/U2_TX/ETH_MDIO/ADC123_IN2)  [also labelled PA2]
ETH_RESET: R66.1 U3.144(PD2/TIM3_ETR/U5_RX/SDIO_CMD/DCMI_D11) U7.15(nRST)  [also labelled PD2]
FSMC_A0: U3.16(PF0/I2C2_SDA/FMC_A0) U5.23(A0)  [also labelled PF0]
FSMC_A1: U3.17(PF1/I2C2_SCL/FMC_A1) U5.24(A1)  [also labelled PF1]
FSMC_A2: U3.18(PF2/I2C2_SMBA/FMC_A2) U5.25(A2)  [also labelled PF2]
FSMC_A3: U3.19(PF3/FMC_A3/ADC3_IN9) U5.26(A3)  [also labelled PF3]
FSMC_A4: U3.20(PF4/FMC_A4/ADC3_IN14) U5.29(A4)  [also labelled PF4]
FSMC_A5: U3.21(PF5/FMC_A5/ADC3_IN15) U5.30(A5)  [also labelled PF5]
FSMC_A6: U3.60(PF12/FMC_A6) U5.31(A6)  [also labelled PF12]
FSMC_A7: U3.63(PF13/FMC_A7) U5.32(A7)  [also labelled PF13]
FSMC_A8: U3.64(PF14/FMC_A8) U5.33(A8)  [also labelled PF14]
FSMC_A9: U3.65(PF15/FMC_A9) U5.34(A9)  [also labelled PF15]
FSMC_A10: U3.66(PG0/FMC_A10) U5.22(A10)  [also labelled PG0]
FSMC_A11: U3.67(PG1/FMC_A11) U5.35(A11)  [also labelled PG1]
FSMC_A12: U3.106(PG2/FMC_A12) U5.36(A12/NC)  [also labelled PG2]
FSMC_A16_CLE: U3.99(PD11/U3_CTS/FMC_A16) U4.16(CLE)  [also labelled PD11]
FSMC_A17_ALE: U3.100(PD12/TIM4_CH1/U3_RTS/FMC_A17) U4.17(ALE)  [also labelled PD12]
FSMC_BA0: U3.108(PG4/FMC_A14/FMC_BA0) U5.20(BA0)  [also labelled PG4]
FSMC_BA1: U3.109(PG5/FMC_A15/FMC_BA1) U5.21(BA1)  [also labelled PG5]
FSMC_D0: U3.104(PD14/TIM4_CH3/FMC_D0) U4.29(I/O0) U5.2(DQ0)  [also labelled PD14]
FSMC_D1: U3.105(PD15/TIM4_CH4/FMC_D1) U4.30(I/O1) U5.4(DQ1)  [also labelled PD15]
FSMC_D2: U3.142(PD0/CAN1_RX/FMC_D2) U4.31(I/O2) U5.5(DQ2)  [also labelled PD0]
FSMC_D3: U3.143(PD1/CAN1_TX/FMC_D3) U4.32(I/O3) U5.7(DQ3)  [also labelled PD1]
FSMC_D4: U3.68(PE7/TIM1_ETR/U7_RX/FMC_D4) U4.41(I/O4) U5.8(DQ4)  [also labelled PE7]
FSMC_D5: U3.69(PE8/TIM1_CH1N/U7_TX/FMC_D5) U4.42(I/O5) U5.10(DQ5)  [also labelled PE8]
FSMC_D6: U3.70(PE9/TIM1_CH1/FMC_D6) U4.43(I/O6) U5.11(DQ6)  [also labelled PE9]
FSMC_D7: U3.73(PE10/TIM1_CH2N/FMC_D7) U4.44(I/O7) U5.13(DQ7)  [also labelled PE10]
FSMC_D8: U3.74(PE11/TIM1_CH2/SPI4_NSS/FMC_D8/LCD_G3) U5.42(DQ8)  [also labelled PE11]
FSMC_D9: U3.75(PE12/TIM1_CH3N/SPI4_SCK/FMC_D9/LCD_B4) U5.44(DQ9)  [also labelled PE12]
FSMC_D10: U3.76(PE13/TIM1_CH3/SPI4_MISO/FMC_D10/LCD_DE) U5.45(DQ10)  [also labelled PE13]
FSMC_D11: U3.77(PE14/TIM1_CH4/SPI4_MOSI/FMC_D11/LCD_CLK) U5.47(DQ11)  [also labelled PE14]
FSMC_D12: U3.78(PE15/TIM1_BKIN/FMC_D12/LCD_R7) U5.48(DQ12)  [also labelled PE15]
FSMC_D13: U3.96(PD8/U3_TX/FMC_D13) U5.50(DQ13)  [also labelled PD8]
FSMC_D14: U3.97(PD9/U3_RX/FMC_D14) U5.51(DQ14)  [also labelled PD9]
FSMC_D15: U3.98(PD10/U3_CK/FMC_D15/LCD_B3) U5.53(DQ15)  [also labelled PD10]
FSMC_NBL0: U3.169(PE0/TIM4_ETR/U8_RX/FMC_NBL0/DCMI_D2) U5.15(LDQM)  [also labelled PE0]
FSMC_NBL1: U3.170(PE1/U8_TX/FMC_NBL1/DCMI_D3) U5.39(UDQM)  [also labelled PE1]
FSMC_NCE3: R37.2 U3.152(PG9/U6_RX/FMC_NE2/FMC_NCE3) U4.9(~{CE})  [also labelled PG9]
FSMC_NOE: U3.146(PD4/U2_RTS/FMC_NOE) U4.8(~{RE})  [also labelled PD4]
FSMC_NWAIT: U3.150(PD6/SPI3_MOSI/I2S3_SD/SAI1_SD_A/U2_RX/FMC_NWAIT/DCMI_D10/LCD_B2) U4.7(R/~{B})  [also labelled PD6]
FSMC_NWE: U3.147(PD5/U2_TX/FMC_NWE) U4.18(~{WE})  [also labelled PD5]
FSMC_SDCKE0: U3.35(PC3/SPI2_MOSI/I2S2_SD/OTG_HS_ULPI_NXT/ETH_MII_TX_CLK/FMC_SDCKE0/ADC123_IN13) U5.37(CKE)  [also labelled PC3]
FSMC_SDCLK: U3.112(PG8/SPI6_NSS/U6_RTS/ETH_PPS_OUT/FMC_SDCLK) U5.38(CLK)  [also labelled PG8]
FSMC_SDNCAS: U3.160(PG15/U6_CTS/FMC_SDNCAS/DCMI_D13) U5.17(~{CAS})  [also labelled PG15]
FSMC_SDNE0: R49.2 U3.34(PC2/SPI2_MISO/I2S2ext_SD/OTG_HS_ULPI_DIR/ETH_MII_TXD2/FMC_SDNE0/ADC123_IN12) U5.19(~{CS})  [also labelled PC2]
FSMC_SDNRAS: U3.59(PF11/SPI5_MOSI/FMC_SDNRAS/DCMI_D12) U5.18(~{RAS})  [also labelled PF11]
FSMC_SDNWE: U3.32(PC0/OTG_HS_ULPI_STP/FMC_SDNWE/ADC123_IN10) U5.16(~{WE})  [also labelled PC0]
I2C1_SCL: R81.2 U3.164(PB6/TIM4_CH1/I2C1_SCL/U1_TX/CAN2_TX/FMC_SDNE1/DCMI_D5) U12.23(SCL)  [also labelled PB6]
I2C1_SDA: R82.2 U3.165(PB7/TIM4_CH2/I2C1_SDA/U1_RX/FMC_NL/DCMI_VSYNC) U12.24(SDA)  [also labelled PB7]
I2C2_SCL: J7.1 U3.45(PH4/I2C2_SCL/OTG_HS_ULPI_NXT)  [also labelled PH4]
I2C2_SDA: J7.2 U3.46(PH5/I2C2_SDA/SPI5_NSS/FMC_SDNWE)  [also labelled PH5]
I2C3_SCL: J8.1 U3.119(PA8/MCO1/TIM1_CH1/I2C3_SCL/U1_CK/OTG_FS_SOF/LCD_R6)  [also labelled PA8]
I2C3_SDA: J8.2 U3.118(PC9/MCO2/TIM3_CH4/TIM8_CH4/I2C3_SDA/I2S_CKIN/SDIO_D1/DCMI_D3)  [also labelled PC9]
KEY1: S2.2 U3.115(PC6/TIM3_CH1/TIM8_CH1/I2S2_MCK/U6_TX/SDIO_D6/DCMI_D0/LCD_HSYNC)  [also labelled PC6]
LCD_B0: RP2.7 U3.3(PE4/SPI4_NSS/SAI1_FS_A/FMC_A20/DCMI_D4/LCD_B0)  [also labelled PE4]
LCD_B1: RP2.5 U3.155(PG12/SPI6_MISO/U6_RTS/FMC_NE4/LCD_B1/LCD_B4)  [also labelled PG12]
LCD_B2: RP2.3 U3.153(PG10/LCD_G3/FMC_NE3/FMC_NCE4_1/DCMI_D2/LCD_B2)  [also labelled PG10]
LCD_B3: RP2.1 U3.154(PG11/ETH_MII_TX_EN/ETH_RMII_TX_EN/FMC_NCE4_2/DCMI_D3/LCD_B3)  [also labelled PG11]
LCD_B4: RP1.7 U3.173(PI4/TIM8_BKIN/FMC_NBL2/DCMI_D5/LCD_B4)  [also labelled PI4]
LCD_B5: RP1.5 U3.174(PI5/TIM8_CH1/FMC_NBL3/DCMI_VSYNC/LCD_B5)  [also labelled PI5]
LCD_B6: RP1.3 U3.175(PI6/TIM8_CH2/FMC_D28/DCMI_D6/LCD_B6)  [also labelled PI6]
LCD_B7: R27.1 R29.1 RP1.1 U3.176(PI7/TIM8_CH3/FMC_D29/DCMI_D7/LCD_B7)  [also labelled PI7]
LCD_BL: R69.1 R70.1 U3.1(PE2/SPI4_SCK/SAI1_MCLK_A/ETH_MII_TXD3/FMC_A23)  [also labelled PE2]
LCD_CLK: RP7.7 U3.111(PG7/U6_CK/FMC_INT3/DCMI_D13/LCD_CLK)  [also labelled PG7]
LCD_DE: RP7.1 U3.28(PF10/FMC_INTR/DCMI_D11/LCD_DE/ADC3_IN8)  [also labelled PF10]
LCD_G0: RP4.7 U3.4(PE5/TIM9_CH1/SPI4_MISO/SAI1_SCK_A/FMC_A21/DCMI_D6/LCD_G0)  [also labelled PE5]
LCD_G1: RP4.5 U3.5(PE6/TIM9_CH2/SPI4_MOSI/SAI1_SD_A/FMC_A22/DCMI_D7/LCD_G1)  [also labelled PE6]
LCD_G2: RP4.3 U3.128(PH13/TIM8_CH1N/CAN1_TX/FMC_D21/LCD_G2)  [also labelled PH13]
LCD_G3: RP4.1 U3.129(PH14/TIM8_CH2N/FMC_D22/DCMI_D4/LCD_G3)  [also labelled PH14]
LCD_G4: RP3.7 U3.130(PH15/TIM8_CH3N/FMC_D23/DCMI_D11/LCD_G4)  [also labelled PH15]
LCD_G5: RP3.5 U3.131(PI0/TIM5_CH4/SPI2_NSS/I2S2_WS/FMC_D24/DCMI_D13/LCD_G5)  [also labelled PI0]
LCD_G6: RP3.3 U3.132(PI1/SPI2_SCK/I2S2_CK/FMC_D25/DCMI_D8/LCD_G6)  [also labelled PI1]
LCD_G7: R24.1 R25.1 RP3.1 U3.133(PI2/TIM8_CH4/SPI2_MISO/I2S2ext_SD/FMC_D26/DCMI_D9/LCD_G7)  [also labelled PI2]
LCD_HS: RP7.5 U3.12(PI10/ETH_MII_RX_ER/FMC_D31/LCD_HSYNC)  [also labelled PI10]
LCD_LR: J1.39(L/R) R6.1 R16.1
LCD_R0: RP6.7 U3.43(PH2/ETH_MII_CRS/FMC_SDCKE0/LCD_R0)  [also labelled PH2]
LCD_R1: RP6.5 U3.44(PH3/ETH_MII_COL/FMC_SDNE0/LCD_R1)  [also labelled PH3]
LCD_R2: RP6.3 U3.85(PH8/I2C3_SDA/FMC_D16/DCMI_HSYNC/LCD_R2)  [also labelled PH8]
LCD_R3: RP6.1 U3.86(PH9/I2C3_SMBA/TIM12_CH2/FMC_D17/DCMI_D0/LCD_R3)  [also labelled PH9]
LCD_R4: RP5.7 U3.87(PH10/TIM5_CH1/FMC_D18/DCMI_D1/LCD_R4)  [also labelled PH10]
LCD_R5: RP5.5 U3.88(PH11/TIM5_CH2/FMC_D19/DCMI_D2/LCD_R5)  [also labelled PH11]
LCD_R6: RP5.3 U3.89(PH12/TIM5_CH3/FMC_D20/DCMI_D3/LCD_R6)  [also labelled PH12]
LCD_R7: R22.1 R23.1 RP5.1 U3.110(PG6/FMC_INT2/DCMI_D12/LCD_R7)  [also labelled PG6]
LCD_RST: C10.2 J1.44(RESET) R20.2 U3.134(PI3/TIM8_ETR/SPI2_MOSI/I2S2_SD/FMC_D27/DCMI_D10)  [also labelled PI3]
LCD_UD: J1.40(U/D) R18.1 R19.1
LCD_VS: RP7.3 U3.11(PI9/CAN1_RX/FMC_D30/LCD_VSYNC)  [also labelled PI9]
LED0: D7.2(K) U3.2(PE3/SAI1_SD_B/FMC_A19)  [also labelled PE3]
LINK_LED: R59.2 U7.3(LED1)
NRF_SWDCLK: BTSWD.2 U9.8(P0.06)
NRF_SWDIO: BTSWD.3 U9.7(P0.05/AIN3)
NRFU_RX: BTU.2 U9.40(P0.28/AIN4)
NRFU_TX: BTU.3 U9.41(P0.29/AIN5)
PA0: U3.40(PA0/WK_UP/TIM2_CH1/TIM2_ETR/TIM5_CH1/TIM8_ETR/U2_CTS/U4_TX/ETH_MII_CRS/ADC123_IN0)  [also labelled WK_UP]
PA1: U3.41(PA1/TIM2_CH2/TIM5_CH2/U2_RTS/U4_RX/ETH_MII_RX_CLK/ETH_RMII_REF_CLK/ADC123_IN1) U7.14(nINT/REFCLKO)  [also labelled RMII_REF_CLK]
PA4: J6.2 U3.50(PA4/SPI1_NSS/SPI3_NSS/I2S3_WS/U2_CK/OTG_HS_SOF/DCMI_HSYNC/LCD_VSYNC/ADC12_IN4/DAC_OUT1)  [also labelled SPI3_NSS]
PA7: U3.53(PA7/TIM1_CH1N/TIM3_CH2/TIM8_CH1N/SPI1_MOSI/TIM14_CH1/ETH_MII_RX_DV/ETH_RMII_CRS_DV/ADC12_IN7) U7.11(CSR_DV/MODE2)  [also labelled RMII_CRS_DV]
PA11: R61.1 U3.122(PA11/TIM1_CH4/U1_CTS/CAN1_RX/LCD_R4/OTG_FS_DM)  [also labelled USB_DM]
PA12: R62.1 U3.123(PA12/TIM1_ETR/U1_RTS/CAN1_TX/LCD_R5/OTG_FS_DP)  [also labelled USB_DP]
PA13: J11.2 R48.1 U3.124(PA13/JTMS/SWDIO)  [also labelled SWDIO]
PA14: J11.3 R50.2 U3.137(PA14/JTCK/SWDCLK)  [also labelled SWDCLK]
PA15: J5.2 U3.138(PA15/JTDI/TIM2_CH1/TIM2_ETR/SPI1_NSS/SPI3_NSS/I2S3_WS)  [also labelled SPI1_NSS]
PB0: SENS1.3 U3.56(PB0/TIM1_CH2N/TIM3_CH3/TIM8_CH2N/LCD_R3/OTG_HS_ULPI_D1/ETH_MII_RXD2/ADC12_IN8)  [also labelled PB8/AIN5]
PB1: SENS1.2 U3.57(PB1/TIM1_CH3N/TIM3_CH4/TIM8_CH3N/LCD_R6/OTG_HS_ULPI_D2/ETH_MII_RXD3/ADC12_IN9)  [also labelled PB9/P28]
PB3: J5.3 U3.161(PB3/JTDO/TIM2_CH2/SPI1_SCK/SPI3_SCK/I2S3_CK)  [also labelled SPI1_SCK]
PB4: J5.4 U3.162(PB4/NJTRST/TIM3_CH1/SPI1_MISO/SPI3_MISO/I2S3ext_SD)  [also labelled SPI1_MISO]
PB5: J5.5 U3.163(PB5/TIM3_CH2/I2C1_SMBA/SPI1_MOSI/SPI3_MOSI/I2S3_SD/CAN2_RX/OTG_HS_ULPI_D7/ETH_PPS_OUT/FMC_SDCKE1/DCMI_D10)  [also labelled SPI1_MOSI]
PB10: U3.79(PB10/TIM2_CH3/I2C2_SCL/SPI2_SCK/I2S2_CK/U3_TX/OTG_HS_ULPI_D3/ETH_MII_RX_ER/LCD_G4)
PB11: U3.80(PB11/TIM2_CH4/I2C2_SDA/U3_RX/OTG_HS_ULPI_D4/ETH_MII_TX_EN/ETH_RMII_TX_EN/LCD_G5) U7.16(TXEN)  [also labelled RMII_TX_EN]
PB12: U3.92(PB12/TIM1_BKIN/I2C2_SMBA/SPI2_NSS/I2S2_WS/U3_CK/CAN2_RX/OTG_HS_ULPI_D5/ETH_MII_TXD0/ETH_RMII_TXD0/OTG_HS_ID) U9.9(P0.07)  [also labelled SPI2_NSS即CS片选]
PB13: U3.93(PB13/TIM1_CH1N/SPI2_SCK/I2S2_CK/U3_CTS/CAN2_TX/OTG_HS_ULPI_D6/ETH_MII_TXD1/ETH_RMII_TXD1/OTG_HS_VBUS) U9.10(P0.08)  [also labelled SPI2_SCK]
PB14: U3.94(PB14/TIM1_CH2N/TIM8_CH2N/SPI2_MISO/I2S2ext_SD/U3_RTS/TIM12_CH1/OTG_HS_DM) U9.11(P0.09)  [also labelled SPI2_MISO]
PB15: U3.95(PB15/RTC_REFIN/TIM1_CH3N/TIM8_CH3N/SPI2_MOSI/I2S2_SD/TIM12_CH2/OTG_HS_DP) U9.12(P0.10)  [also labelled SPI2_MOSI]
PC4: U3.54(PC4/ETH_MII_RXD0/ETH_RMII_RXD0/ADC12_IN14) U7.8(RXD0/MODE0)  [also labelled RMII_RXD0]
PC5: U3.55(PC5/ETH_MII_RXD1/ETH_RMII_RXD1/ADC12_IN15) U7.7(RXD1/MODE1)  [also labelled RMII_RXD1]
PC7: J2.3(D+) R62.2 R65.2 U3.116(PC7/TIM3_CH2/TIM8_CH2/I2S3_MCK/U6_RX/SDIO_D7/DCMI_D1/LCD_G6)  [also labelled USB控制]
PC8: U3.117(PC8/TIM3_CH3/TIM8_CH3/U6_CK/SDIO_D0/DCMI_D2)
PC10: J6.3 U3.139(PC10/SPI3_SCK/I2S3_CK/U3_TX/U4_TX/SDIO_D2/DCMI_D8/LCD_R2)  [also labelled SPI3_SCK]
PC11: J6.5 U3.140(PC11/I2S3ext_SD/SPI3_MISO/U3_RX/U4_RX/SDIO_D3/DCMI_D4)  [also labelled SPI3_MOSI]
PC12: J6.4 U3.141(PC12/SPI3_MOSI/I2S3_SD/U3_CK/U5_TX/SDIO_CK/DCMI_D9)  [also labelled SPI3_MISO]
PC14: C29.1 U3.9(PC14/OSC32_IN) Y1.2(OSC2)
PC15: C30.1 U3.10(PC15/OSC32_OUT) Y1.1(OSC1)
PD3: U3.145(PD3/SPI2_SCK/I2S2_CK/U2_CTS/FMC_CLK/DCMI_D5/LCD_G7) U6.46(WAKE)  [also labelled TP_WAKE]
PD7: U3.151(PD7/U2_CK/FMC_NE1/FMC_NCE2)
PD13: U3.101(PD13/TIM4_CH2/FMC_A18)
PF6: U3.24(PF6/TIM10_CH1/SPI5_NSS/SAI1_SD_B/U7_RX/FMC_NIORD/ADC3_IN4)  [also labelled SPI5_NSS]
PF7: U3.25(PF7/TIM11_CH1/SPI5_SCK/SAI1_MCLK_B/U7_TX/FMC_NREG/ADC3_IN5)  [also labelled SPI5_SCK]
PF8: U3.26(PF8/TIM13_CH1/SPI5_MISO/SAI1_SCK_B/FMC_NIOWR/ADC3_IN6)  [also labelled SPI5_MISO]
PF9: U3.27(PF9/TIM14_CH1/SPI5_MOSI/SAI1_FS_B/FMC_CD/ADC3_IN7)  [also labelled SPI5_MOSI]
PG3: U3.107(PG3/FMC_A13) U6.43(MOSI/SDA)  [also labelled TP_SDA]
PG13: U3.156(PG13/SPI6_SCK/U6_CTS/ETH_MII_TXD0/ETH_RMII_TXD0/FMC_A24) U7.17(TXD0)  [also labelled RMII_TXD0]
PG14: U3.157(PG14/SPI6_MOSI/U6_TX/ETH_MII_TXD1/ETH_RMII_TXD1/FMC_A25) U7.18(TXD1)  [also labelled RMII_TXD1]
PH6: U3.83(PH6/I2C2_SMBA/SPI5_SCK/TIM12_CH1/ETH_MII_RXD2/FMC_SDNE1/DCMI_D8) U6.41(SSEL/SCL)  [also labelled TP_SCL]
PH7: U3.84(PH7/I2C3_SCL/SPI5_MISO/ETH_MII_RXD3/FMC_SDCKE1/DCMI_D9) U6.47(INT)  [also labelled TP_INT]
PI8: U3.7(PI8/TAMP_2)
PI11: U3.13(PI11/OTG_HS_ULPI_DIR)
RESET: C110.2 R21.1 S1.1 U3.31(NRST) U6.45(~{RST})
RF: C91.2 E1.1(A) L6.2
RX1: J3.20 U6.53(RX1)
RX2: J3.21 U6.54(RX2)
RX3: J3.22 U6.55(RX3)
RX4: J3.23 U6.56(RX4)
RX5: J3.24 U6.57(RX5)
RX6: J3.25 U6.58(RX6)
RX7: J3.26 U6.59(RX7)
RX8: J3.27 U6.60(RX8)
RX9: J3.28 U6.61(RX9)
RX10: J3.29 U6.62(RX10)
SPEED_LED: R60.2 U7.2(LED2)
TFT_B0: J1.19(B0) RP2.8
TFT_B1: J1.18(B1) RP2.6
TFT_B2: J1.17(B2) RP2.4
TFT_B3: J1.16(B3) RP2.2
TFT_B4: J1.15(B4) RP1.8
TFT_B5: J1.14(B5) RP1.6
TFT_B6: J1.13(B6) RP1.4
TFT_B7: J1.12(B7) RP1.2
TFT_CLK: J1.37(DCLK) RP7.8
TFT_DE: J1.9(DE) RP7.2
TFT_G0: J1.27(G0) RP4.8
TFT_G1: J1.26(G1) RP4.6
TFT_G2: J1.25(G2) RP4.4
TFT_G3: J1.24(G3) RP4.2
TFT_G4: J1.23(G4) RP3.8
TFT_G5: J1.22(G5) RP3.6
TFT_G6: J1.21(G6) RP3.4
TFT_G7: J1.20(G7) RP3.2
TFT_HS: J1.11(HS) RP7.6
TFT_R0: J1.35(R0) RP6.8
TFT_R1: J1.34(R1) RP6.6
TFT_R2: J1.33(R2) RP6.4
TFT_R3: J1.32(R3) RP6.2
TFT_R4: J1.31(R4) RP5.8
TFT_R5: J1.30(R5) RP5.6
TFT_R6: J1.29(R6) RP5.4
TFT_R7: J1.28(R7) RP5.2
TFT_VS: J1.10(VS) RP7.4
TPRX+: R57.2 U7.23(RXP)
TPRX-: R58.2 U7.22(RXN)
TPTX+: R55.2 U7.21(TXP)
TPTX-: R56.2 U7.20(TXN)
TX1: J3.2 U6.31(TX1)
TX2: J3.3 U6.30(TX2)
TX3: J3.4 U6.29(TX3)
TX4: J3.5 U6.28(TX4)
TX5: J3.6 U6.27(TX5)
TX6: J3.7 U6.26(TX6)
TX7: J3.8 U6.25(TX7)
TX8: J3.9 U6.24(TX8)
TX9: J3.10 U6.23(TX9)
TX10: J3.11 U6.22(TX10)
TX11: J3.12 U6.21(TX11)
TX12: J3.13 U6.20(TX12)
TX13: J3.14 U6.19(TX13)
TX14: J3.15 U6.18(TX14)
TX15: J3.16 U6.17(TX15)
U1_RX: J4.3 U3.121(PA10/TIM1_CH3/U1_RX/OTG_FS_ID/DCMI_D1)
U1_TX: J4.2 U3.120(PA9/TIM1_CH2/I2C3_SMBA/U1_TX/DCMI_D0/OTG_FS_VBUS)
VREF+: C21.2 C22.2 R31.2 R40.2 U3.38(VREF+)
NetC17_2: C17.2 C18.2 J1.6(Vcom) J1.46(Vcom) R26.1 R28.1
NetC20_2: C20.2 U3.81(VCAP_1)
NetC23_2: C23.2 U3.125(VCAP_2)
NetC24_2: C24.2 C25.2 R32.1 U4.12(VCC) U4.37(VCC)
NetC31_1: C31.1 U3.29(PH0/OSC_IN) Y2.3(HOT)
NetC32_2: C32.2 U3.30(PH1/OSC_OUT) Y2.1(HOT)
NetC33_2: C33.2 R51.1 U6.52(VDDA)
NetC62_2: C62.2 U6.35(VDDD)
NetC63_2: C63.2 U6.32(VDD5)
NetC65_2: C65.2 C66.2 U7.6(VDDCR)
NetC70_1: C70.1 R68.2 U7.4(XTAL2) Y3.2(OSC2)
NetC71_1: C71.1 R68.1 U7.5(XTAL1/CLKIN) Y3.1(OSC1)
NetC75_2: C75.2 L3.1 U9.46(DEC4)
NetC76_1: C76.1 U9.35(XC2) X1.3(out)
NetC77_1: C77.1 U9.2(P0.00/XL1) X2.1(inp)
NetC80_1: C80.1 U9.34(XC1) X1.1(inp)
NetC81_1: C81.1 U9.3(P0.01/XL2) X2.2(out)
NetC83_1: C83.1 U9.33(DEC3)
NetC85_1: C85.1 C86.2 D15.1(A) L7.2 U11.1(SW)
NetC85_2: C85.2 D12.3
NetC86_1: C86.1 D11.3
NetC87_2: C87.2 D10.1 D12.1
NetC88_1: C88.1 D11.2 D14.2
NetC90_2: C90.2 L6.1 U9.30(ANT)
NetC95_2: C95.2 R74.2 R75.1 U11.3(FB)
NetC116_1: C116.1 U12.20(CPOUT)
NetC117_2: C117.2 U12.10(RESOUT)
NetD6_1: D6.1(A) R46.2
NetD7_1: D7.1(A) R47.2
NetD8_1: D8.1(A) J2.1(VCC)
NetD9_1: D9.1(A) L4.2 U8.1(SW)
NetJ1_8: J1.8(MODE) R17.2
NetJ2_2: J2.2(D-) R61.2
NetL3_2: L3.2 L5.1
NetL5_2: L5.2 U9.47(DCC)
NetQ4_1: Q4.1(G) R40.1 R43.2
NetR30_2: R30.2 U3.48(BYPASS_REG)
NetR35_2: R35.2 R36.2 U3.171(PDR_ON)
NetR39_1: R39.1 U4.19(~{WP})
NetR54_1: R54.1 U7.12(MDIO)
NetR70_2: R70.2 U8.4(EN)
NetR200_1: R200.1 U7.24(RBIAS)

Not connected (* = marked no-connect by the designer): C73 1 2; J1 45(NC)* 49(NC)* 50(NC)*; R72 1 2; U1 5(VRF)*; U6 2(NC) 3(NC) 4(TX28) 5(TX27) 6(TX26) 7(TX25) 8(TX24) 9(TX23) 10(TX22) 11(TX21) 12(TX20) 13(TX19) 14(TX18) 15(TX17) 16(TX16) 36(TEST_EN) 37(GPIO0) 38(GPIO1) 39(GPIO2) 40(GPIO3) 42(SCK) 44(MISO) 48(NC) 49(NC) 50(NC) 51(NC) 63(RX11) 64(RX12) 65(RX13) 66(RX14) 67(RX15) 68(RX16); U9 4(P0.02/AIN0) 5(P0.03/AIN1) 6(P0.04/AIN2) 14(P0.11) 15(P0.12) 16(P0.13) 17(P0.14) 18(P0.15) 19(P0.16) 20(P0.17) 21(P0.18) 22(P0.19) 23(P0.20) 25(SWDCLK) 26(SWDIO) 27(P0.22)* 28(P0.23)* 29(P0.24)* 32(DEC2)* 37(P0.25) 38(P0.26) 39(P0.27) 42(P0.30/AIN6) 43(P0.31/AIN7) 44(N.C.) 49(GND); U12 2(NC)* 3(NC)* 4(NC)* 5(NC)* 6(AUX_DA)* 7(AUX_CL)* 12(INT)* 14(NC)* 15(NC)* 16(NC)* 17(NC)* 19(RESV)* 21(RESV)* 22(CLKOUT)*

### Notes on the sheet
- 到底用不用接电源和地啊
- 要不就全放到母板上
- 2.封装0408查
- 1.原理0408查
- 地没有分有没有大影响？
- 5V3V3的焊点先去掉
- (near R19) 控制屏幕方向（左右、上下）
- 多外接的线
- (near S1) 复位按键
- 默认焊最上和最下
- 接个IO应该也行
- CORE电源,电源都想从母板引
- 为了以防万一留下，使CORE独立
- FSMC的线不用外接了！！
- 干簧管
- 线性霍尔
- (near C19) 换个二极管行了
- (near R29) 初始化时程序读取LCD_R/G/B7状态，以获取ID
- (near U4) NAND_FLASH
- 板对板连接器有的
- (near R30) VBAT-VDD
- (near R31) 默认不焊
- 从而判断屏幕尺寸和分辨率
- 此处可接不同RGB屏
- 407用0R电阻接了3V3
- 如果0R不焊接就要接外部参考电压
- (near C22) 原407主板上的P5可以控制VREF+
- PA11
- PA12
- (near R35) 默认不焊
- (near R36) 默认焊
- (near J1) 屏和触摸引脚顺序对的
- (near Q4) 根本就没有用大功率电阻锕
- (near J1) BGR
- 一会找个地方放
- 先放这
- NRF_CS再找个地，要求好也不高
- 只有F7用到
- (near U5) SDRAM
- 留43个IO+7个电源和地
- JTAG7和9脚
- 这些不用接，原本也没接
- 429原版在PB5但是5不能用了
- 数据使能
- 场同步信号
- 行同步信号
- 最大370MA
- (near RP7) 在429端有固定端口
- 先用个500MA的吧
- 32SWD烧录口
- (near J3) TP
- (near S2) 32串口
- (near U6) 焊盘可以再长点
- (near C40) 跟DATASHEET引脚一致
- (near J4) 换两次试试吧
- 看一下还有没有变化的引脚端口
- (near C62) 先用50V的替代一下
- A0可以去
- 去掉
- (near D8) 我有有点怀疑对不对了
- 换一个USB口也行，这是跟CORE板一样的接口
- 是不是需要接个三极管？407是这样429并未显示
- (near J7) I2C
- USB SLAVE从设备插头
- 本来没有
- 参考时钟开0.148W,关0.168W
- 内部转1.2V
- I2C
- (near C72) 不要也行429没画
- (near U8) 效率算85%
- 去掉，地方小
- (near U12) 中间大焊盘悬空
- BT
- 电路电阻精度<=1%
- LCD
- (near U12) 大焊盘接地但不焊
- (near P3) XH254线序不可改，占地方，稳定再加
- (near SENS1) 不行换5个孔行了
- (near X1) 设置component=value好像能解决
- 原来不对
- (near D14) 用5V1代替吧
- (near U12) 不能在非屏蔽层下布有源信号下面铺四层地行了
- (near RJ1) 应该没错哦
- (near D12) 0.2W
- (near D11) 0.2W
- POE可提供350MA/12.95W,POE+700MA/30W
- 这两个电容到底干啥的
- 效率算85%
- (near R74) 设IPK=IAV则0.2W
- (near R75) IMAX=0.4A
- MCU+RADIO
- TXRX看情况
- (near BTU) TTL 调试接口
- (near BTSWD) BTSWD烧录口
- Labels drawn without touching a wire or pin: 3V3, 52832RESET, +5V, +10.4V, +16V, -7V, AD1, AD2, AD3, BL_GND, BL_VCC, BOOT0, BOOT1, CAN1_RX, CAN1_TX, ETH_MDC, ETH_MDIO, ETH_RESET, FSMC_A16_CLE, FSMC_A17_ALE, FSMC_NCE3, FSMC_NOE, FSMC_NWAIT, FSMC_NWE, GND, I2C2_SCL, I2C2_SDA, I2C3_SCL, I2C3_SDA, KEY1, LCD_BL, LCD_CLK, LCD_DE, LCD_HS, LCD_VS, LED0, LED_BLUE, LED_GREEN, LED_RED, NRF_CE, NRF_CS, PA0, PA1, PA2, PA3, PA4, PA5, PA6, PA7, PA8, PA9, PA10, PA11, PA12, PA13, PA14, PA15, PB0, PB1, PB2, PB3, PB4, PB5, PB6, PB7, PB8, PB8/AIN5, PB9, PB9/P28, PB10, PB11, PB12, PB13, PB14, PB15, PC0, PC1, PC2, PC3, PC4, PC5, PC6, PC7, PC8, PC9, PC10, PC11, PC12, PC13, PC14, PC15, PD0, PD1, PD2, PD3, PD4, PD5, PD6, PD7, PD8, PD9, PD10, PD11, PD12, PD13, PD14, PD15, PE0, PE1, PE2, PE3, PE4, PE5, PE6, PE7, PE8, PE9, PE10, PE11, PE12, PE13, PE14, PE15, PF0, PF1, PF2, PF3, PF4, PF5, PF6, PF7, PF8, PF9, PF10, PF11, PF12, PF13, PF14, PF15, PG0, PG1, PG2, PG3, PG4, PG5, PG6, PG7, PG8, PG9, PG10, PG11, PG12, PG13, PG14, PG15, PH2, PH3, PH4, PH5, PH6, PH7, PH8, PH9, PH10, PH11, PH12, PH13, PH14, PH15, PI0, PI3, PI9, PI10, PI11, RESET, RMII_CRS_DV, RMII_REF_CLK, RMII_RXD0, RMII_RXD1, RMII_TX_EN, RMII_TXD0, RMII_TXD1, SPDIF_RX, SPI1_MISO, SPI1_MOSI, SPI1_NSS, SPI1_SCK, SPI2_MISO, SPI2_MOSI, SPI2_NSS即CS片选, SPI2_SCK, SPI3_MISO, SPI3_MOSI, SPI3_NSS, SPI3_SCK, SWDCLK, SWDIO, TFT_DE, TP_INT, TP_SCL, TP_SDA, TP_WAKE, USART1_RX, USART1_TX, USB_DM, USB_DP, USB控制, VREF+
- Title
- Size:
- Date:
- File:
- A1
- Number:
- Time:
- Revision:
- Sheet
- of
- (in symbol FT5406EE8) QFN68_8X8
- (in symbol nRF52832_QFAA) nRF52832

### Library data of the parts
BTSWD BTU = CON4: Connector
C2 C10 C17 C18 C24 C25 C33-C40 C62-C69 C72-C74 C84-C89 C92-C95 = Cap: Capacitor; Published: 8-Jun-2000; LatestRevisionDate: 17-Jul-2002; LatestRevisionNote: Re-released for DXP Platform.; PackageReference: RAD-0.3; Publisher: Altium Limited; PackageDescription: Radial Cap, Thru-Hole; 2 Leads; 0.3 in Pin Spacing
  C2 C10 C18 C24 C25 C34-C40 C65 C67-C69 C92: Value: 104
  C17 C73 C74 C84-C86 C88: Value: 105
  C33 C62-C64: Value: 1uF/10V
  C66 C72 C93 C94: Value: 106
  C87 C89: Value: 4.7uF
  C95: Value: 22P
C19-C23 C26-C32 C42-C47 C53-C61 C70 C71 C110 C117 = C: 电容; Published: 8-Jun-2000; LatestRevisionDate: 17-Jul-2002; LatestRevisionNote: Re-released for DXP Platform.; PackageReference: RAD-0.3; Publisher: Altium Limited; PackageDescription: Radial Cap, Thru-Hole; 2 Leads; 0.3 in Pin Spacing
C41 = C Pol
C75 = C0603-1μ0: Capacitor, X7R, ±10%; Note: 16V; Artikkelnr Noca: 20039335; Artikkelnr Simpro: N.A.; Part Number: C0603-1μ0; Manufacturer: *; Manufacturer Part Number: *; Datasheet: *; LatestRevisionDate: 2013-06-05; Pin Count: 2; Publisher: Nordic Semiconductor; Published: 2009-05-08; Value: 1.0uF; Supplier: *; Supplier part number: *; 2nd source Supplier: *; 2nd source part number: *; Footprint Doc: 0603
C76 C77 C80 C81 = C0402-12p: Capacitor, NP0, ±2%; Note: 50V; Artikkelnr Noca: 20029159; Artikkelnr Simpro: N.A.; Part Number: C0402-12p; Manufacturer: *; Manufacturer Part Number: *; Datasheet: *; LatestRevisionDate: 2011-05-11; Pin Count: 2; Publisher: Nordic Semiconductor; Published: 2009-05-08; Value: 12pF; Supplier: *; Supplier part number: *; 2nd source Supplier: *; 2nd source part number: *; Footprint Doc: 0402
C78 C82 C96 = C0402-100n: Capacitor, X7R, ±10%; Value: 100nF; Note: 16V; Artikkelnr Noca: 20039200; Artikkelnr Simpro: N.A.; Part Number: C0402-100n; Manufacturer: *; Manufacturer Part Number: *; Datasheet: *; LatestRevisionDate: 2009-11-23; Pin Count: 2; Publisher: Nordic Semiconductor; Published: 2009-05-08; Supplier: *; Supplier part number: *; 2nd source Supplier: *; 2nd source part number: *; Footprint Doc: 0402
C79 = C0603-4μ7: Capacitor, X5R, ±10%; Note: 6.3V; Artikkelnr Noca: 20069060; Artikkelnr Simpro: N.A.; Part Number: C0603-4μ7; Manufacturer: *; Manufacturer Part Number: *; Datasheet: *; LatestRevisionDate: 2009-11-23; Pin Count: 2; Publisher: Nordic Semiconductor; Published: 2009-05-08; Value: 4.7uF; Supplier: *; Supplier part number: *; 2nd source Supplier: *; 2nd source part number: *; Footprint Doc: 0603
C83 = C0402-100p: Capacitor, NP0, ±5%; Note: 50V; Artikkelnr Noca: 20029135; Artikkelnr Simpro: N.A.; Part Number: C0402-100p; Manufacturer: *; Manufacturer Part Number: *; Datasheet: *; LatestRevisionDate: 2009-05-08; Pin Count: 2; Publisher: Nordic Semiconductor; Published: 2009-05-08; Value: 100pF; Supplier: *; Supplier part number: *; 2nd source Supplier: *; 2nd source part number: *; Footprint Doc: 0402
C90 C91 = C0402-0.8p: Capacitor, NP0, ±5%; Note: 50V; Artikkelnr Noca: 20029147; Artikkelnr Simpro: N.A.; Part Number: C0402-0.8p; Manufacturer: *; Manufacturer Part Number: *; Datasheet: *; LatestRevisionDate: 2012-11-21; Pin Count: 2; Publisher: Nordic Semiconductor; Published: 2009-05-08; Supplier: *; Supplier part number: *; 2nd source Supplier: *; 2nd source part number: *; Footprint Doc: 0402
  C90: Value: 0.8pF
  C91: Value: 1.2pF
C116 = C: 无极性贴片电容; 版权归属: 源创客; BOM名称: 无极性贴片电容; 学习资源: www.ooocke.com
D6 D7 = LED3: Typical BLUE SiC LED; Published: 8-Jun-2000; LatestRevisionDate: 17-Dec-2003; LatestRevisionNote: PCB Footprint replaced.; DatasheetVersion: 16-Apr-2002; PackageVersion: 16-Apr-2002; PackageReference: 3.5X2.8X1.9; Publisher: Altium Limited; PackageDescription: SM LED; 2 C-Bend Leads; Body 3.5 x 2.8 x 1.9 mm, inc leads (LxWxH typ)
D8 = Diode: Default Diode; Published: 8-Jun-2000; LatestRevisionDate: 17-Jul-2002; LatestRevisionNote: Re-released for DXP Platform.; PackageVersion: Sep-1996; PackageReference: SMC; Publisher: Altium Limited; PackageDescription: DO-214-AB/SMC; 2 C-Bend Leads; Body 7.9 x 5.9 mm, inc. leads (LxW); Code_JEDEC: DO-214-AB
D9 D15 = Diode 1N5400: 3 Amp General Purpose Rectifier; Published: 8-Jun-2000; LatestRevisionDate: 17-Jul-2002; LatestRevisionNote: Re-released for DXP Platform.; DatasheetVersion: 1998; PackageVersion: Aug-1999; PackageReference: DO-201AD; Publisher: Altium Limited; PackageDescription: Diode, Axial; Body 9.5 x 5.6 mm (LxDia. max), Lead Dia. 1.32 mm (max); ComponentLink1Description: Manufacturer Link; ComponentLink1URL: http://www.fairchildsemi.com/; ComponentLink2Description: Datasheet; ComponentLink2URL: http://www.fairchildsemi.com/ds/1N%2F1N5400.pdf
D10 = ZMM3V6: ZMM3V6封装为LL34
D11 D12 = BAT54S: 双肖特基二极管
D14 = ZMM3V6
E1 = Antenna: Generic Antenna; Published: 24-Mar-1999; LatestRevisionDate: 17-Jul-2002; LatestRevisionNote: Re-released for DXP Platform.; PackageReference: PIN1; Publisher: Altium Limited
J1 = AT070TN92: 7' TFTLCD
J2 = USB4
J3 = HEADER30
J4 J11 = Header 4: Header, 4-Pin; LatestRevisionDate: 17-Jul-2002; LatestRevisionNote: Re-released for DXP Platform.; Publisher: Altium Limited
J5 J6 = Header 6: Header, 6-Pin; LatestRevisionDate: 17-Jul-2002; LatestRevisionNote: Re-released for DXP Platform.; Publisher: Altium Limited
J7 J8 = Header 2: Header, 2-Pin; LatestRevisionDate: 17-Jul-2002; LatestRevisionNote: Re-released for DXP Platform.; Publisher: Altium Limited
L3 = L0402-15n: High frequency chip inductor ±10%; Manufacturer: Taiyo Yuden; Manufacturer Part Number: HK100515NJ-T; 2nd source part number: 658-1328; Artikkelnr Noca: 33029323; Artikkelnr Simpro: N.A.; Part Number: L0402-15n; LatestRevisionDate: 2012-09-19; Pin Count: 2; Publisher: Nordic Semiconductor; Published: 2010-07-12; Value: 15nH; Note: High frequency chip inductor ±10%; Supplier: Digi-Key; Datasheet: http://www.yuden.co.jp/productdata/catalog/en/mlci04_e.pdf; Supplier part number: 587-1521-1-ND; 2nd source Supplier: Farnell; Footprint Doc: 0402
L4 L7 = Inductor: Code_IEC: 1005; Published: 8-Jun-2000; LatestRevisionDate: 29-May-2009; LatestRevisionNote: IPC-7351 Footprint Added.; PackageReference: 0402-A; Publisher: Altium Limited; PackageDescription: Chip Inductor; Code_JEITA: 0402
L5 = L0603-10μ: Chip inductor, IDC,min = 50 mA, ±20%; Manufacturer: Taiyo Yuden; Manufacturer Part Number: LBMF1608T100K; 2nd source part number: 178-6105; Note: LBMF1608T100K 10μH 80mA 0603; Artikkelnr Noca: 33029314; Artikkelnr Simpro: N.A.; Part Number: L0603-10μ; Datasheet: http://www.yuden.co.jp/ut/product/pdf/elb2_e.pdf; LatestRevisionDate: 2012-09-19; Pin Count: 2; Publisher: Nordic Semiconductor; Published: 2010-02-24; Value: 10uH; Supplier: Digi-Key; Supplier part number: 587-1714-1-ND; 2nd source Supplier: Farnell; Footprint Doc: 0603
L6 = L0402-3n9: High frequency chip inductor ±5%; Manufacturer: Murata; Manufacturer Part Number: LQP15MN3N9B02D; Artikkelnr Noca: 33029151; Artikkelnr Simpro: N.A.; Part Number: L0402-3n9; Datasheet: http://search.murata.co.jp/Ceramy/image/img/PDF/ENG/L0075S0084LQP15M.pdf; LatestRevisionDate: 2012-09-19; Pin Count: 2; Publisher: Nordic Semiconductor; Published: 2009-05-08; Value: 3.9nH; Note: High frequency chip inductor ±5%; Supplier: Digi-Key; Supplier part number: 490-1131-1-ND; 2nd source Supplier: *; 2nd source part number: *; Footprint Doc: 0402
P1-P3 = Header 3_1: Header, 3-Pin; LatestRevisionDate: 17-Jul-2002; LatestRevisionNote: Re-released for DXP Platform.; Publisher: Altium Limited
Q4 = MOSFET-P: P-Channel MOSFET; Published: 8-Jun-2000; LatestRevisionDate: 17-Jul-2002; LatestRevisionNote: Re-released for DXP Platform.; PackageVersion: 1995/1996; PackageReference: E3; Publisher: Altium Limited; PackageDescription: TO, Flat Index; 3 In-Line, Axial Leads; Body Dia. 4.6mm; Lead Dia. 0.5 mm (max)
R6 R16-R32 R34-R37 R39 R40 R43 R46-R53 R55-R62 R65 R66 R68-R72 R74 R75 = Res2: Resistor
  R6 R16 R18-R20 R22 R23 R26 R30 R37 R39 R49 R53 R59 R60 R70: Published: 8-Jun-2000; LatestRevisionDate: 17-Jul-2002; LatestRevisionNote: Re-released for DXP Platform.; PackageReference: AXIAL-0.4; Publisher: Altium Limited; PackageDescription: Axial Device, Thru-Hole; 2 Leads; 0.4 in Pin Spacing; Value: 10K
  R17 R21 R24 R25 R27 R29 R32 R35 R36 R48 R50 R52 R56 R58 R66 R71 R72: Published: 8-Jun-2000; LatestRevisionDate: 17-Jul-2002; LatestRevisionNote: Re-released for DXP Platform.; PackageReference: AXIAL-0.4; Publisher: Altium Limited; PackageDescription: Axial Device, Thru-Hole; 2 Leads; 0.4 in Pin Spacing
  R28: Published: 8-Jun-2000; LatestRevisionDate: 17-Jul-2002; LatestRevisionNote: Re-released for DXP Platform.; PackageReference: AXIAL-0.4; Publisher: Altium Limited; PackageDescription: Axial Device, Thru-Hole; 2 Leads; 0.4 in Pin Spacing; Value: 5.6K
  R31 R34 R40 R51: Published: 8-Jun-2000; LatestRevisionDate: 17-Jul-2002; LatestRevisionNote: Re-released for DXP Platform.; PackageReference: AXIAL-0.4; Publisher: Altium Limited; PackageDescription: Axial Device, Thru-Hole; 2 Leads; 0.4 in Pin Spacing; Value: 10R
  R43 R75: Published: 8-Jun-2000; LatestRevisionDate: 17-Jul-2002; LatestRevisionNote: Re-released for DXP Platform.; PackageReference: AXIAL-0.4; Publisher: Altium Limited; PackageDescription: Axial Device, Thru-Hole; 2 Leads; 0.4 in Pin Spacing; Value: 100K
  R46 R47: Published: 8-Jun-2000; LatestRevisionDate: 17-Jul-2002; LatestRevisionNote: Re-released for DXP Platform.; PackageReference: AXIAL-0.4; Publisher: Altium Limited; PackageDescription: Axial Device, Thru-Hole; 2 Leads; 0.4 in Pin Spacing; Value: 1K
  R55 R57: Published: 8-Jun-2000; LatestRevisionDate: 17-Jul-2002; LatestRevisionNote: Re-released for DXP Platform.; PackageReference: AXIAL-0.4; Publisher: Altium Limited; PackageDescription: Axial Device, Thru-Hole; 2 Leads; 0.4 in Pin Spacing; Value: 49.9R
  R68: Published: 8-Jun-2000; LatestRevisionDate: 17-Jul-2002; LatestRevisionNote: Re-released for DXP Platform.; PackageReference: AXIAL-0.4; Publisher: Altium Limited; PackageDescription: Axial Device, Thru-Hole; 2 Leads; 0.4 in Pin Spacing; Value: 1M
  R69: Published: 8-Jun-2000; LatestRevisionDate: 17-Jul-2002; LatestRevisionNote: Re-released for DXP Platform.; PackageReference: AXIAL-0.4; Publisher: Altium Limited; PackageDescription: Axial Device, Thru-Hole; 2 Leads; 0.4 in Pin Spacing; Value: 4.7K
  R74: Published: 8-Jun-2000; LatestRevisionDate: 17-Jul-2002; LatestRevisionNote: Re-released for DXP Platform.; PackageReference: AXIAL-0.4; Publisher: Altium Limited; PackageDescription: Axial Device, Thru-Hole; 2 Leads; 0.4 in Pin Spacing; Value: 732K
R54 R73 R200 = R
R81 R82 = R: 贴片电阻; 版权归属: 源创客; BOM名称: 贴片电阻; 学习资源: www.ooocke.com
RJ1 SENS1 = SIP5
RP1-RP7 = R_PACK: 排阻
S1 S2 = SW-PB: Switch; Published: 24-Mar-1999; LatestRevisionDate: 17-Jul-2002; LatestRevisionNote: Re-released for DXP Platform.; PackageReference: SPST-2; Publisher: Altium Limited; PackageDescription: Switch; 2 Leads
U1 = TJA1050: CAN总线收发器
U4 = K9F2G08U0C: 256MB NAND FLASH
U5 = IS42S16160B: 32MB SDRAM
U7 = LAN8720
U8 = MP3302: LCD背光IC
U9 = nRF52832_QFAA: Multi-protocol Bluetooth Low Energy, ANT and 2.4GHz proprietary system-on-chip; Manufacturer: Nordic Semiconductor; Artikkelnr Noca: N.A.; Part Number: nRF52832-QFAA; Manufacturer Part Number: nRF52832-QFAA; Datasheet: *; LatestRevisionDate: 2014-11-26; Pin Count: 48; Publisher: Nordic Semiconductor; Published: 2014-11-26; Value: nRF52832-QFAA; Note: *; Supplier: Nordic Semiconductor; Supplier part number: *; 2nd source Supplier: *; 2nd source part number: *; Footprint Doc: QFN-48; Artikkelnr Simpro: N.A.
U11 = TPS61040: DC DC Step Up IC
X1 = XTAL_SMD2016_32MHz_8pF_General: XTAL SMD 2016, 32MHz, Cl=8pF, Total Tol: ±40ppm; Note: XTAL SMD 32.000MHz; Artikkelnr Noca: N.A.; Part Number: XTAL_SMD2016_32MHz_8pF_General; Manufacturer: *; Manufacturer Part Number: *; Datasheet: *; LatestRevisionDate: 2016-08-19; Pin Count: 4; Publisher: Nordic Semiconductor; Published: 2016-08-19; Value: 32MHz; Supplier: *; Supplier part number: *; 2nd source Supplier: *; 2nd source part number: *; Footprint Doc: XTAL_2016; Artikkelnr Simpro: N.A.
X2 = XTAL_SMD3215_32.768kHz_9pF_General: XTAL SMD 3215, 32.768kHz, Cl=9pF, Total Tol: ±50ppm; Note: XTAL SMD 32.768kHz; Artikkelnr Noca: N.A.; Part Number: XTAL_SMD3215_32.768kHz_9pF_General; Manufacturer: *; Manufacturer Part Number: *; Datasheet: *; LatestRevisionDate: 2016-08-19; Pin Count: 2; Publisher: Nordic Semiconductor; Published: 2016-08-19; Value: 32.768kHz; Supplier: *; Supplier part number: *; 2nd source Supplier: *; 2nd source part number: *; Footprint Doc: XTAL_3215; Artikkelnr Simpro: N.A.
Y1 Y3 = XTAL: Crystal Oscillator; Published: 8-Jun-2000; LatestRevisionDate: 17-Jul-2002; LatestRevisionNote: Re-released for DXP Platform.; Publisher: Altium Limited
Y2 = XTAL_3225: 3225贴片无源晶振

## Nets that join several sheets
3V3: POWER (C99.2 C100.2 U18.2), 407VS429 (95 pins)
+5V: POWER (9 pins), 407VS429 (14 pins)
GND: POWER (26 pins), 407VS429 (160 pins)
LINK_LED: POWER (J9.12), 407VS429 (R59.2 U7.3)
SPEED_LED: POWER (J9.9), 407VS429 (R60.2 U7.2)
TPRX+: POWER (T1.6), 407VS429 (R57.2 U7.23)
TPRX-: POWER (T1.8), 407VS429 (R58.2 U7.22)
TPTX+: POWER (T1.1), 407VS429 (R55.2 U7.21)
TPTX-: POWER (T1.3), 407VS429 (R56.2 U7.20)